# Altium project Hardware Design.PrjPcb (part 1 of 2)
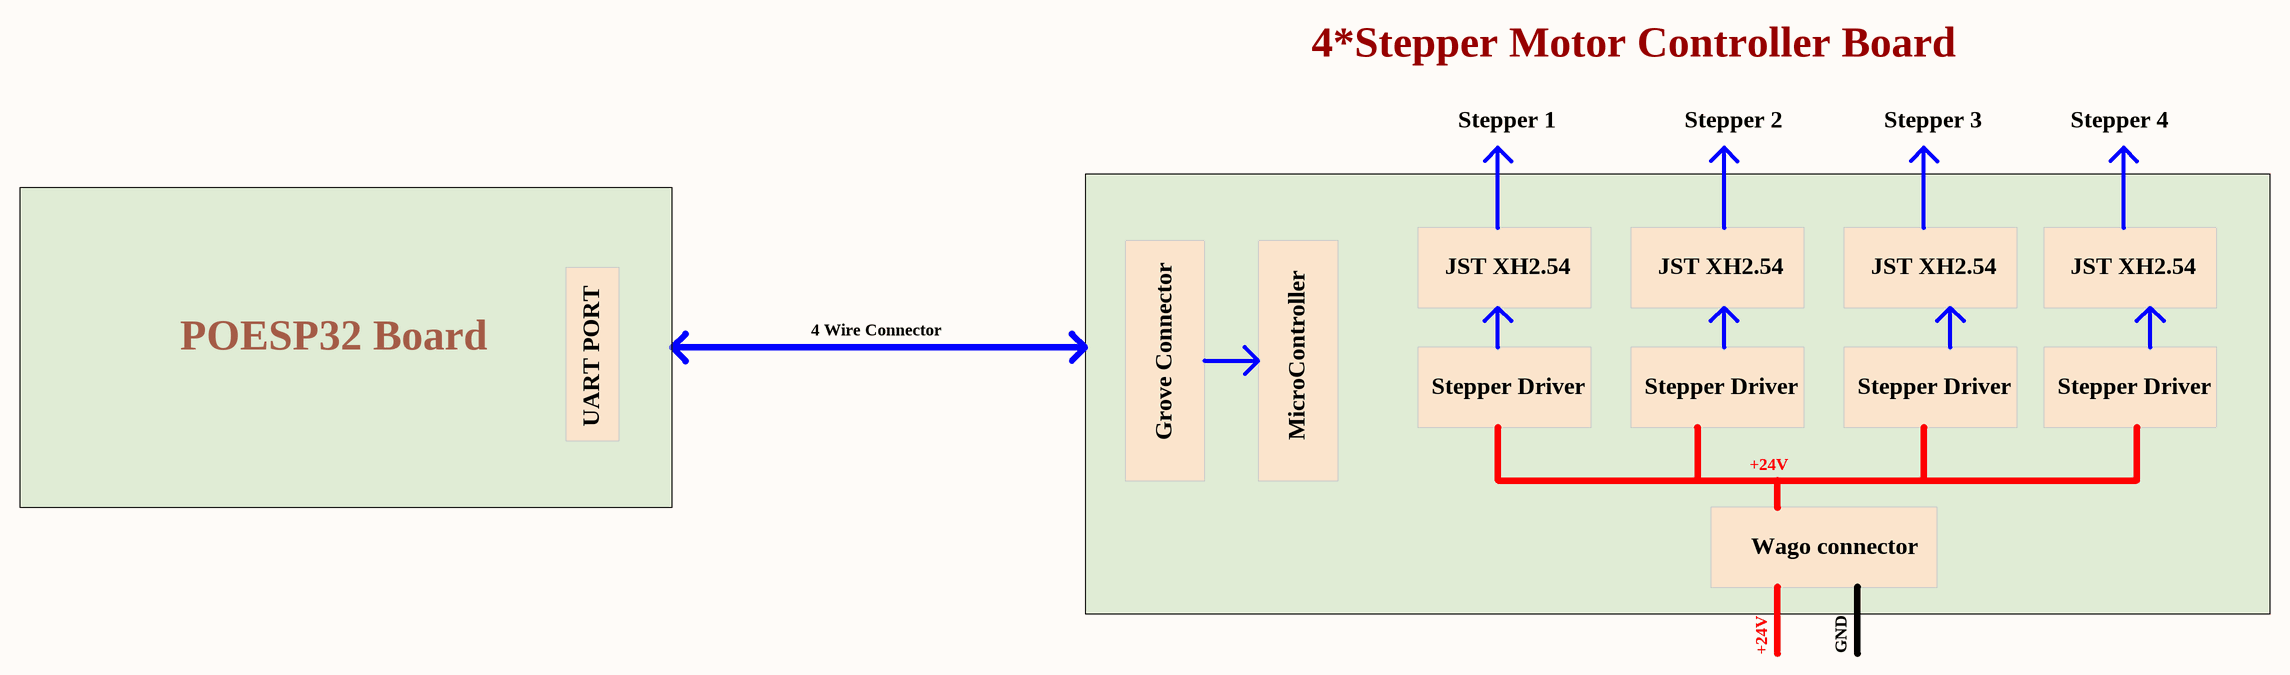
[diagram p0: SysOverView.SchDoc]
9 sheets, 264 parts. Net scope: global (net labels, ports and power ports of the same name join across sheets).
Board file: SystemV1.PcbDoc
Sheets:
  SysOverView.SchDoc
  POWER.SchDoc
  STM.SchDoc
  Stepper Motor1.SchDoc
  Stepper Motor2.SchDoc
  Stepper Motor3.SchDoc
  Stepper Motor4.SchDoc
  Stepper Motor5.SchDoc
  Stepper Motor6.SchDoc

## Sheet SysOverView.SchDoc
size A2; SheetNumber: 1; SheetTotal: 7

### Notes on the sheet
- 4*Stepper Motor Controller Board
- Stepper 1
- Stepper 2
- Stepper 3
- Stepper 4
- JST XH2.54
- POESP32 Board
- 4 Wire Connector
- UART PORT
- Grove Connector
- MicroController
- Stepper Driver
- +24V
- Wago connector
- GND

## Sheet POWER.SchDoc
size A2; SheetNumber: 2; SheetTotal: 9
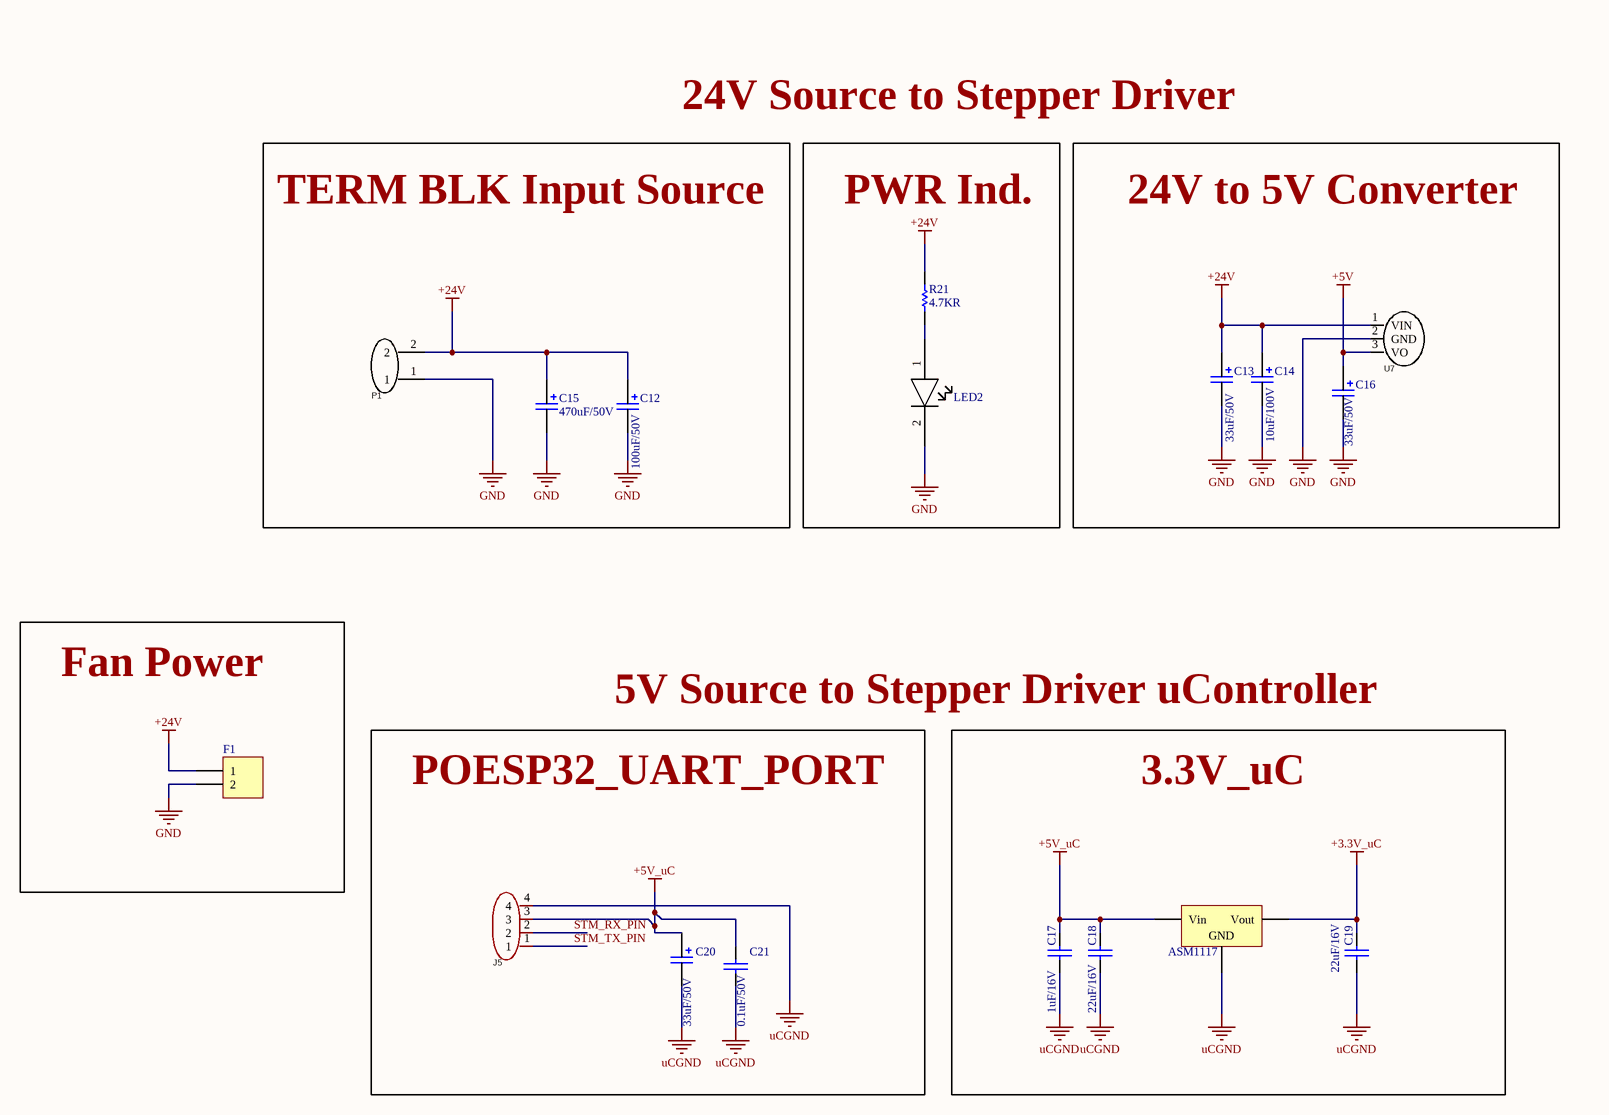
[diagram p1: POWER.SchDoc]

### Parts
ASM1117  AMS1117 - 3.3V Reg  [SOT229P700X180-4N]  (value not drawn)
C12  100uF/50V  [CAPLEAD_D6.3mm]
C13  33uF/50V  [CAPLEAD_D6.3mm]
C14  10uF/100V  [CAPLEAD_D6.3mm]
C15  470uF/50V  [CAPLEAD_D10mm]
C16  33uF/50V  [CAPLEAD_D6.3mm]
C17  1uF/16V  [PCBComponent_1]
C18  22uF/16V  [PCBComponent_1]
C19  22uF/16V  [PCBComponent_1]
C20  33uF/50V  [CAPLEAD_D6.3mm]
C21  0.1uF/50V  [PCBComponent_1]
F1  (no value)  [PinHeader Polar]
J5  Header 4P*2mm  [CONN-TH_4P-P2.00_HX20020-4A_2]  (value not drawn)
LED2  1206 LED  [1206 LED]  (value not drawn)
P1  WJ45C-B-9.5-2P  [CONN-TH_2P-P9.50_WJ45C-B-2P]  (value not drawn)
R21  4.7KR  [R0402]
U7  C5369649  [SIP-3]  (value not drawn)

### Blocks framed on the sheet
TERM BLK Input Source: C12 C15 P1
PWR Ind.: LED2 R21
24V to 5V Converter: C13 C14 C16 U7
Fan Power: F1
POESP32_UART_PORT: C20 C21 J5
3.3V_uC: ASM1117 C17-C19

### Nets
+3.3V_uC: ASM1117.Vout C19.2
+5V: C16.1 U7.3(VO)
+5V_uC: ASM1117.Vin C17.2 C18.2 C20.1 C21.2 J5.3
+24V: C12.1 C13.1 C14.1 C15.1 F1.1 P1.2 R21.1 U7.1(VIN)
GND: C12.2 C13.2 C14.2 C15.2 C16.2 F1.2 LED2.2 P1.1 U7.2(GND)
uCGND: ASM1117.GND C17.1 C18.1 C19.1 C20.2 C21.1 J5.4
STM_RX_PIN: J5.2
STM_TX_PIN: J5.1
NetLED2_1: LED2.1 R21.2

### Notes on the sheet
- 24V Source to Stepper Driver
- 5V Source to Stepper Driver uController

### Library data of the parts
ASM1117 = AMS1117 - 3.3V Reg: C347222; Created By: NourAldin
C12 = A759EQ475M2AAAE160: C47891; Manufacturer: KEMET; Supplier 1: Mouser; Manufacturer Part Number: A759EQ475M2AAAE160; RoHS: Yes; Category: Polymer Capacitors; Stock 1: 17219; Pricing 1: 1=0.97, 10=0.73, 50=0.73, 100=0.546, 1000=0.384, 10000=0.326 (USD); ComponentLink1URL: http://www.kemet.com/docfinder?Partnumber=A759EQ475M2AAAE160&src-supplier=Digikey; ComponentLink1Description: http://www.kemet.com/docfinder?Partnumber=A759EQ475M2AAAE160&src-supplier=Digikey; ComponentLink2URL: http://www.farnell.com/datasheets/2095614.pdf?src-supplier=Element14; ComponentLink2Description: http://www.farnell.com/datasheets/2095614.pdf?src-supplier=Element14; Supplier Part Number 1: 80-A759EQ475M2AAE160
C13 C16 C20 = A759EQ475M2AAAE160: C45099; Manufacturer: KEMET; Supplier 1: Mouser; Manufacturer Part Number: A759EQ475M2AAAE160; RoHS: Yes; Category: Polymer Capacitors; Stock 1: 17219; Pricing 1: 1=0.97, 10=0.73, 50=0.73, 100=0.546, 1000=0.384, 10000=0.326 (USD); ComponentLink1URL: http://www.kemet.com/docfinder?Partnumber=A759EQ475M2AAAE160&src-supplier=Digikey; ComponentLink1Description: http://www.kemet.com/docfinder?Partnumber=A759EQ475M2AAAE160&src-supplier=Digikey; ComponentLink2URL: http://www.farnell.com/datasheets/2095614.pdf?src-supplier=Element14; ComponentLink2Description: http://www.farnell.com/datasheets/2095614.pdf?src-supplier=Element14; Supplier Part Number 1: 80-A759EQ475M2AAE160
C14 = A759EQ475M2AAAE160: C2029; Manufacturer: KEMET; Supplier 1: Mouser; Manufacturer Part Number: A759EQ475M2AAAE160; RoHS: Yes; Category: Polymer Capacitors; Stock 1: 17219; Pricing 1: 1=0.97, 10=0.73, 50=0.73, 100=0.546, 1000=0.384, 10000=0.326 (USD); ComponentLink1URL: http://www.kemet.com/docfinder?Partnumber=A759EQ475M2AAAE160&src-supplier=Digikey; ComponentLink1Description: http://www.kemet.com/docfinder?Partnumber=A759EQ475M2AAAE160&src-supplier=Digikey; ComponentLink2URL: http://www.farnell.com/datasheets/2095614.pdf?src-supplier=Element14; ComponentLink2Description: http://www.farnell.com/datasheets/2095614.pdf?src-supplier=Element14; Supplier Part Number 1: 80-A759EQ475M2AAE160
C15 = MAL215058101E3: C2960279; Manufacturer: Vishay BCcomponents; Manufacturer Part Number: MAL215058101E3; RoHS: Yes; Category: Aluminum Electrolytic Capacitors; Stock 1: 1562; Pricing 1: 1=1.45, 10=1.09, 50=1.09, 100=0.799, 1000=0.585, 10000=0.496 (USD); ComponentLink1URL: https://datasheet.ciiva.com/11697/150rmi-11697723.pdf?src-supplier=Avnet; ComponentLink1Description: https://datasheet.ciiva.com/11697/150rmi-11697723.pdf?src-supplier=Avnet; Supplier 1: Mouser; Supplier 2: LCSC; Supplier Part Number 2: C1596751; Supplier Part Number 1: 594-2222-150-58101
C17 = 0603 Capacitor: C1592; Created By: NourAldin; DataSheet Link: https://eu.mouser.com/datasheet/2/400/lcc_automotive_general_en-843974.pdf; Mouser Link: https://eu.mouser.com/ProductDetail/TDK/CGA1A2X7R1H331M030BA?qs=sGAEpiMZZMs0AnBnWHyRQL8L3bkL%252bvtyS9XpSB1mk7rVV5K8%252bbxEeg%3d%3d
C18 C19 = 0603 Capacitor: C2762594; Created By: NourAldin; DataSheet Link: https://eu.mouser.com/datasheet/2/400/lcc_automotive_general_en-843974.pdf; Mouser Link: https://eu.mouser.com/ProductDetail/TDK/CGA1A2X7R1H331M030BA?qs=sGAEpiMZZMs0AnBnWHyRQL8L3bkL%252bvtyS9XpSB1mk7rVV5K8%252bbxEeg%3d%3d
C21 = 0603 Capacitor: C1591; Created By: NourAldin; DataSheet Link: https://eu.mouser.com/datasheet/2/400/lcc_automotive_general_en-843974.pdf; Mouser Link: https://eu.mouser.com/ProductDetail/TDK/CGA1A2X7R1H331M030BA?qs=sGAEpiMZZMs0AnBnWHyRQL8L3bkL%252bvtyS9XpSB1mk7rVV5K8%252bbxEeg%3d%3d
F1 = Header 2 pin: C492401; Created By: NourAldin
J5 = ZX-HY2.0-4PZZ: C42372479; Manufacturer: Megastar(兆星); Add into BOM: yes; Pins Structure: 1x4P; Pitch: 2mm; Reference Series: HY; Number of PINs Per Row: 4; Current Rating (Max): 2A; Rated Voltage (Max): 250V; Flame Retardant Rating: UL94V-0; Z-Height of the Board: 8mm; X-Length of Bottom Edge on Board (Spacing Line): 10mm; Y-Width of Bottom Edge on Board: 5.1mm; Symbol: ZX-HY2.0-4PZZ; Device: ZX-HY2.0-4PZZ; LCSC Part Name: 1x4P 间距:2mm 直插 系列:HY 配套胶壳型号：ZX-HY2.0-4PJK 配套端子型号：ZX-HY2.0-DZ 配套杜邦线型号：ZX-HY2.0-4PBXC; Supplier Part: C7429580; Manufacturer Part: ZX-HY2.0-4PZZ; Supplier Footprint: 插件,P=2mm; JLCPCB Part Class: Extended Part; Datasheet: https://atta.szlcsc.com/upload/public/pdf/source/20241025/5A7CD93910E89EF197073334521200FC.pdf; Supplier: LCSC; Convert to PCB: yes; Mounting Style: Direct Insert; Number of Pins: 4P; Number of Rows: 1; Row Spacing: -; Contact Material: Brass; Contact Plating: Tin; Operating Temperature Range: -25℃~+85℃; Plastic Material: -; Supplementary Features: -; Colour: White
LED2 = 1206 LED: C434442; Created By: NourAldin
P1 = WJ45C-B-9.5-2P: C8397; Manufacturer: KANGNEX(康奈克斯电气); Symbol: WJ45C-B-2P; Add into BOM: yes; Barrier Type: 两面; Pitch: 9.5mm; Structure: 1x2P; Pin Location: 中脚; Current Rating (Max): 32A; Voltage Rating (Max): 750V; Wire Gauge - AWG: 12~22; Wire Gauge - mm2: 4; Number of PINs Per Row: 2; Device: WJ45C-B-9.5-2P; LCSC Part Name: 9.5mm 1x2P 每排P数:2 排数:1 直针 中脚; Supplier Part: C8397; Manufacturer Part: WJ45C-B-9.5-2P; Supplier Footprint: 插件,P=9.5mm; JLCPCB Part Class: Extended Part; Datasheet: https://atta.szlcsc.com/upload/public/pdf/source/20191225/C8397_C0B2C2E73138A510EBF0F13B91F71912.pdf; Supplier: LCSC; Convert to PCB: yes; Mounting Style: 直针; Number of Pins: 2P; Number of Rows: 1; Operating Temperature Range: -40℃~+105℃; Color: Black
R21 = 0402 Resistor: C105871
U7 = K7805M-1000R3_C5369649: Manufacturer: YLPTEC(易川); Add into BOM: yes; Conversion Type: DC-DC; Function: Boost type; Input Voltage(DC): 7V~36V; Output Voltage: 5V; Output Power: 5W; Output Current (Max): 1000mA; Output Channel: 1; Conversion Efficiency: 94%; Maximum Capacitive Load: 2200uF; Symbol: K7805M-1000R3_C5369649; Device: K7805M-1000R3_C5369649; LCSC Part Name: K7805M-1000R3; Supplier Part: C5369649; Manufacturer Part: K7805M-1000R3; Supplier Footprint: SIP-3; JLCPCB Part Class: Extended Part; Datasheet: https://atta.szlcsc.com/upload/public/pdf/source/20230612/70568B8922D00E56BE7D7C892197C716.pdf; Supplier: LCSC; Convert to PCB: yes; Feature: Short-Circuit  Protection；Low-Power Consumption

## Sheet STM.SchDoc
size B; SheetNumber: 3; SheetTotal: 9
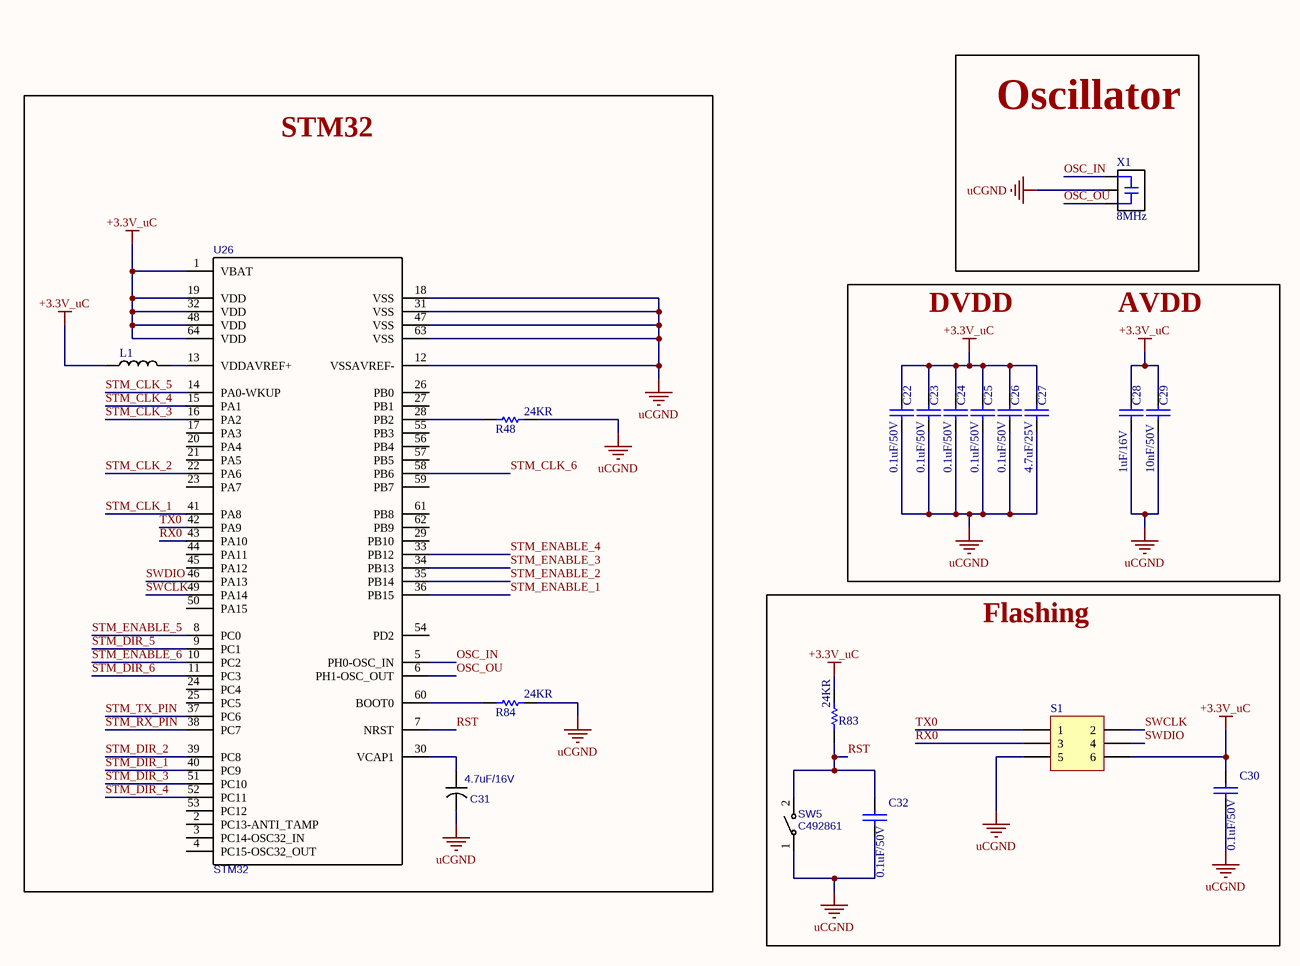
[diagram p2: STM.SchDoc]

### Parts
C22  0.1uF/50V  [PCBComponent_1]
C23  0.1uF/50V  [PCBComponent_1]
C24  0.1uF/50V  [PCBComponent_1]
C25  0.1uF/50V  [PCBComponent_1]
C26  0.1uF/50V  [PCBComponent_1]
C27  4.7uF/25V  [PCBComponent_1]
C28  1uF/16V  [PCBComponent_1]
C29  10nF/50V  [PCBComponent_1]
C30  0.1uF/50V  [PCBComponent_1]
C31  4.7uF/16V  [CASE-B_3528]
C32  0.1uF/50V  [PCBComponent_1]
L1  CMI201209X100KT  [INDC2012X06N]  (value not drawn)
R48  24KR  [RESC1608X06N]
R83  24KR  [RESC1608X06N]
R84  24KR  [RESC1608X06N]
S1  Header 3X2  [HDR2X3]  (value not drawn)
SW5  C492861  [SW-SMD_L4.0-W3.0-LS4.8]
U26  STM32  [LQFP-64_L10.0-W10.0-P0.50-LS12.0-BL]
X1  8MHz  [SMD3213-3P]

### Blocks framed on the sheet
Oscillator: X1
STM32: C31 L1 R48 R84 U26
Flashing: C30 C32 R83 S1 SW5

### Nets
+3.3V_uC: C22.2 C23.2 C24.2 C25.2 C26.2 C27.2 C28.2 C29.2 C30.2 L1.1 R83.1 S1.6 U26.1(VBAT) U26.19(VDD) U26.32(VDD) U26.48(VDD) U26.64(VDD)
uCGND: C22.1 C23.1 C24.1 C25.1 C26.1 C27.1 C28.1 C29.1 C30.1 C31.2 C32.1 R48.1 R84.1 S1.5 SW5.1 U26.12(VSSAVREF-) U26.18(VSS) U26.31(VSS) U26.47(VSS) U26.63(VSS) X1.2
OSC_IN: U26.5(PH0-OSC_IN) X1.1
OSC_OU: U26.6(PH1-OSC_OUT) X1.3
RST: C32.2 R83.2 SW5.2 U26.7(NRST)
RX0: S1.3 U26.43(PA10)
STM_CLK_1: U26.41(PA8)
STM_CLK_2: U26.22(PA6)
STM_CLK_3: U26.16(PA2)
STM_CLK_4: U26.15(PA1)
STM_CLK_5: U26.14(PA0-WKUP)
STM_CLK_6: U26.58(PB6)
STM_DIR_1: U26.40(PC9)
STM_DIR_2: U26.39(PC8)
STM_DIR_3: U26.51(PC10)
STM_DIR_4: U26.52(PC11)
STM_DIR_5: U26.9(PC1)
STM_DIR_6: U26.11(PC3)
STM_ENABLE_1: U26.36(PB15)
STM_ENABLE_2: U26.35(PB14)
STM_ENABLE_3: U26.34(PB13)
STM_ENABLE_4: U26.33(PB12)
STM_ENABLE_5: U26.8(PC0)
STM_ENABLE_6: U26.10(PC2)
STM_RX_PIN: U26.38(PC7)
STM_TX_PIN: U26.37(PC6)
SWCLK: S1.2 U26.49(PA14)
SWDIO: S1.4 U26.46(PA13)
TX0: S1.1 U26.42(PA9)
NetC31_1: C31.1 U26.30(VCAP1)
NetL1_2: L1.2 U26.13(VDDAVREF+)
NetR48_2: R48.2 U26.28(PB2)
NetR84_2: R84.2 U26.60(BOOT0)

Not connected (* = marked no-connect by the designer): U26 2(PC13-ANTI_TAMP) 3(PC14-OSC32_IN) 4(PC15-OSC32_OUT) 17(PA3) 20(PA4) 21(PA5) 23(PA7) 24(PC4) 25(PC5) 26(PB0) 27(PB1) 29(PB10) 44(PA11) 45(PA12) 50(PA15) 53(PC12) 54(PD2) 55(PB3) 56(PB4) 57(PB5) 59(PB7) 61(PB8) 62(PB9)

### Notes on the sheet
- DVDD
- AVDD

### Library data of the parts
C22-C26 C30 C32 = 0603 Capacitor: C1591; Created By: NourAldin; DataSheet Link: https://eu.mouser.com/datasheet/2/400/lcc_automotive_general_en-843974.pdf; Mouser Link: https://eu.mouser.com/ProductDetail/TDK/CGA1A2X7R1H331M030BA?qs=sGAEpiMZZMs0AnBnWHyRQL8L3bkL%252bvtyS9XpSB1mk7rVV5K8%252bbxEeg%3d%3d
C27 = 0603 Capacitor: C69335; Created By: NourAldin; DataSheet Link: https://eu.mouser.com/datasheet/2/400/lcc_automotive_general_en-843974.pdf; Mouser Link: https://eu.mouser.com/ProductDetail/TDK/CGA1A2X7R1H331M030BA?qs=sGAEpiMZZMs0AnBnWHyRQL8L3bkL%252bvtyS9XpSB1mk7rVV5K8%252bbxEeg%3d%3d
C28 = 0603 Capacitor: C1592; Created By: NourAldin; DataSheet Link: https://eu.mouser.com/datasheet/2/400/lcc_automotive_general_en-843974.pdf; Mouser Link: https://eu.mouser.com/ProductDetail/TDK/CGA1A2X7R1H331M030BA?qs=sGAEpiMZZMs0AnBnWHyRQL8L3bkL%252bvtyS9XpSB1mk7rVV5K8%252bbxEeg%3d%3d
C29 = 0603 Capacitor: C100042; Created By: NourAldin; DataSheet Link: https://eu.mouser.com/datasheet/2/400/lcc_automotive_general_en-843974.pdf; Mouser Link: https://eu.mouser.com/ProductDetail/TDK/CGA1A2X7R1H331M030BA?qs=sGAEpiMZZMs0AnBnWHyRQL8L3bkL%252bvtyS9XpSB1mk7rVV5K8%252bbxEeg%3d%3d
C31 = 3528  Tantalum Cap: C7206; Manufacturer: Kyocera AVX; Manufacturer Part: TAJR106K006RNJ; nameAlias: Value; Contributor: LCSC; Supplier: LCSC; Supplier Part: C132274; JLCPCB Part Class: Extended Part; spicePre: C; spiceSymbolName: TAJR106K006RNJ
L1 = 0805 SMD INDUCTOR: C99366; Created By: NourAldin
R48 R83 R84 = 0603 Resistor: C2930081; Created By: NourAldin; Mouser Link: https://eu.mouser.com/ProductDetail/Panasonic/ERA-3AHD180V?qs=sGAEpiMZZMvdGkrng054t5mej2KPdPuFSlDBd1tSiF0%3d; DataSheet Link: https://eu.mouser.com/datasheet/2/315/AOA0000C307-1149632.pdf
S1 = Header 3X2: C42431837; LatestRevisionDate: 17-Jul-2002; LatestRevisionNote: Re-released for DXP Platform.; Publisher: Altium Limited
SW5 = tact switch: Manufacturer: Yuandi(元迪); Manufacturer Part: TS-1071AS-A1B3-D4; Contributor: LCSC; Supplier: LCSC; Supplier Part: C492861; JLCPCB Part Class: Extended Part; spicePre: S; spiceSymbolName: TS-1071AS-A1B3-D4
U26 = STM32F401RCT6: C74524; Manufacturer: ST(意法半导体); Supplier: LCSC; Manufacturer Part: STM32F401RCT6; Supplier Part: C74524; JLCPCB Part Class: Extended Part; spicePre: U; spiceSymbolName: STM32F401RCT6
X1 = CSTCE16M0V53-R0: C907975; Manufacturer: Murata; Frequency: 16MHz; Frequency Stability: 0.3%; Frequency Tolerance: 0.5%; Capacitance: 15pF; Impedance: 40R; Supplier 1: Digi-Key; Manufacturer Part Number: CSTCE16M0V53-R0; RoHS: Yes; Category: Resonators; Mount: Surface Mount; Case/Package: SMD/SMT; Min Operating Temperature: -40°C; Max Operating Temperature: 85°C; Packaging: Cut Tape; Series: CERALOCK® CSTNE; RoHS Compliant: Yes; ComponentLink1URL: https://www.murata.com/en/products/productdata/8801162231838/SPEC-CSTNE16M0V530000R0.pdf?src-supplier=Digi-Key; ComponentLink1Description: https://www.murata.com/en/products/productdata/8801162231838/SPEC-CSTNE16M0V530000R0.pdf?src-supplier=Digi-Key; LCSC Link: https://www.lcsc.com/product-detail/Ceramic-Resonators_Murata-Electronics-CSTCE16M0V53-R0_C32180.html; Supplier Part Number 1: 490-1198-2-ND; Supplier Part Number 2: C32180

## Sheet Stepper Motor1.SchDoc
size A2; SheetNumber: 4; SheetTotal: 9
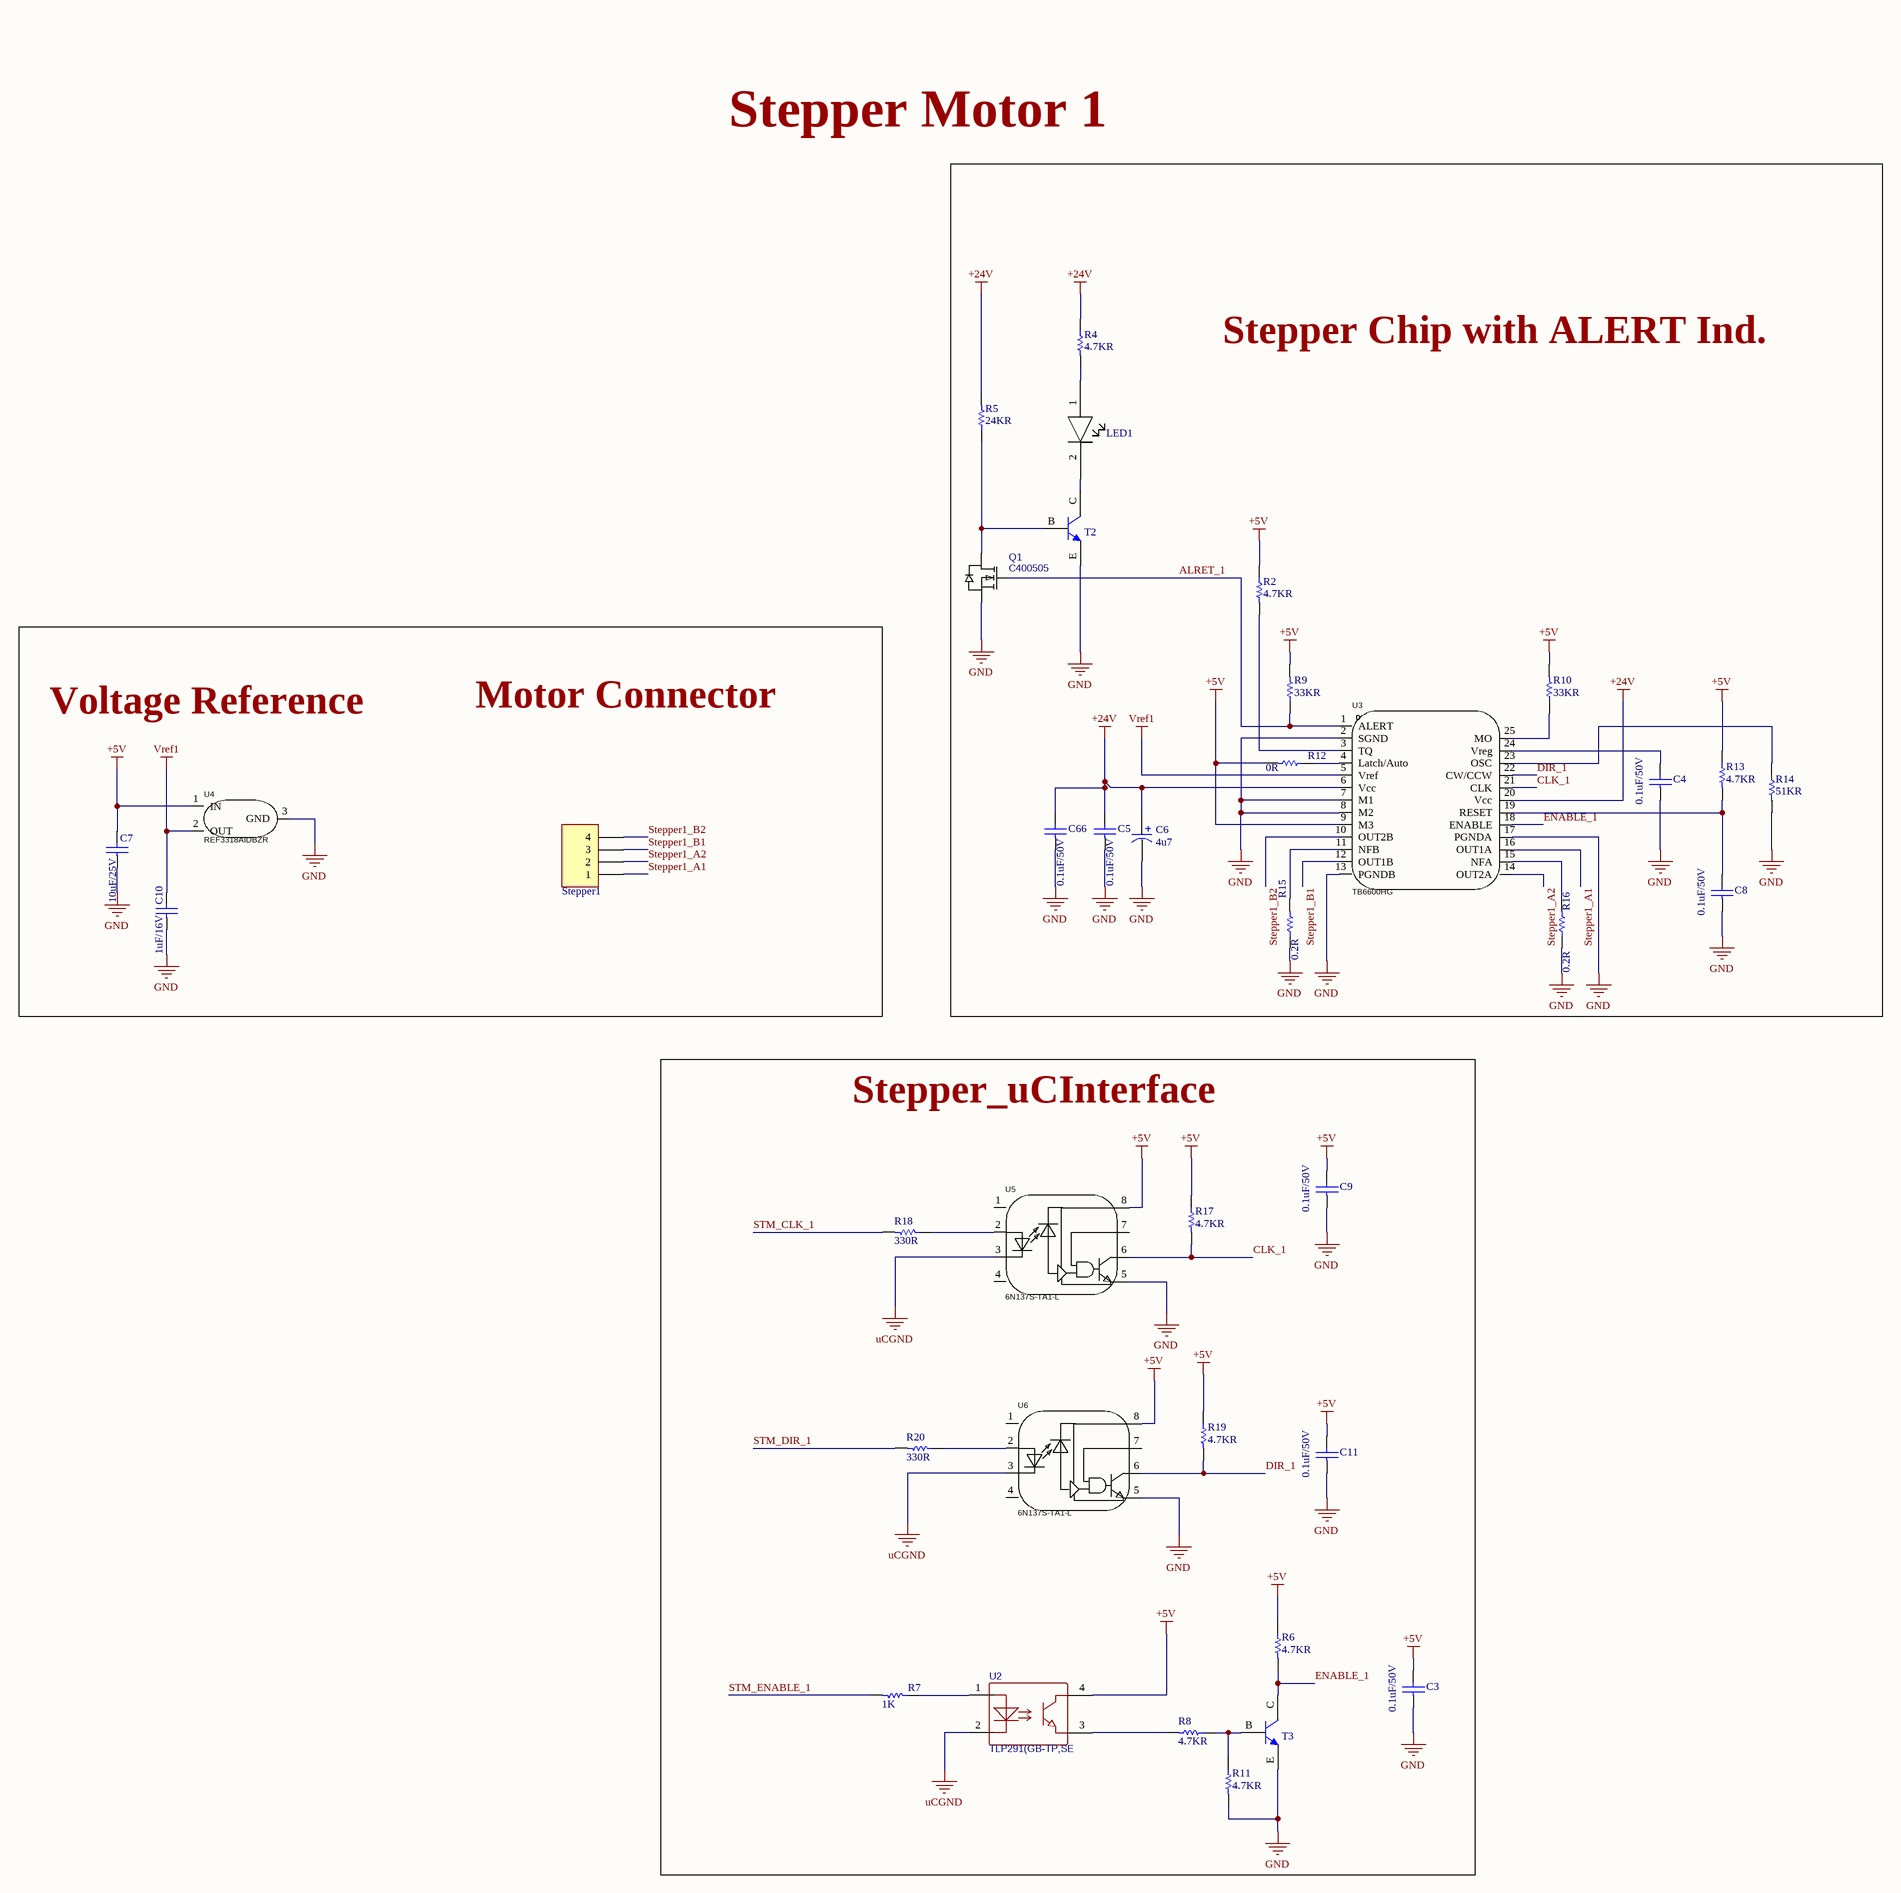
[diagram p3: Stepper Motor1.SchDoc]

### Parts
C3  0.1uF/50V  [PCBComponent_1]
C4  0.1uF/50V  [PCBComponent_1]
C5  0.1uF/50V  [PCBComponent_1]
C6  4u7  [CAPLEAD_D6.3mm]
C7  10uF/25V  [PCBComponent_1]
C8  0.1uF/50V  [PCBComponent_1]
C9  0.1uF/50V  [PCBComponent_1]
C10  1uF/16V  [PCBComponent_1]
C11  0.1uF/50V  [PCBComponent_1]
C66  0.1uF/50V  [PCBComponent_1]
LED1  1206 LED  [1206 LED]  (value not drawn)
Q1  C400505  [SOT-23-3_L2.9-W1.3-P1.90-LS2.4-BR]
R2  4.7KR  [R0402]
R4  4.7KR  [R0402]
R5  24KR  [RESC1608X06N]
R6  4.7KR  [R0402]
R7  1K  [R0402]
R8  4.7KR  [R0402]
R9  33KR  [RESC1608X06N]
R10  33KR  [RESC1608X06N]
R11  4.7KR  [R0402]
R12  0R  [RESC1608X06N]
R13  4.7KR  [R0402]
R14  51KR  [R0402]
R15  0.2R  [RESC6431X12N]
R16  0.2R  [RESC6431X12N]
R17  4.7KR  [R0402]
R18  330R  [R0402]
R19  4.7KR  [R0402]
R20  330R  [R0402]
Stepper1  Header 4 Pin Polar  [PCBComponent_1]  (value not drawn)
T2  MMBT3904 Transistor  [MMBT3904]  (value not drawn)
T3  MMBT3904 Transistor  [MMBT3904]  (value not drawn)
U2  TLP291(GB-TP,SE  [SOP-4-1.27mm]
U3  TB6600HG  [HZIP25-P-1.0_TB6600HG - HEATSINK]
U4  REF3318AIDBZR  [SOT-23-3_L2.9-W1.3-P1.90-LS2.4-BR]
U5  6N137S-TA1-L  [SOP-8_L9.8-W6.6-P2.54-LS10.3-BL]
U6  6N137S-TA1-L  [SOP-8_L9.8-W6.6-P2.54-LS10.3-BL]

### Blocks framed on the sheet
Stepper Chip with ALERT Ind.: C4-C6 C8 C66 LED1 Q1 R2 R4 R5 R9 R10 R12-R16 T2 U3
Stepper_uCInterface: C3 C9 C11 R6-R8 R11 R17-R20 T3 U2 U5 U6

### Nets
+5V: C3.2 C7.2 C9.2 C11.2 R2.1 R6.1 R9.2 R10.2 R12.2 R13.1 R17.1 R19.1 U2.4 U3.9(M3) U4.1(IN) U5.8 U6.8
+24V: C5.2 C6.1 C66.2 R4.1 R5.2 U3.6(Vcc) U3.20(Vcc)
GND: C3.1 C4.1 C5.1 C6.2 C7.1 C8.1 C9.1 C10.1 C11.1 C66.1 Q1.2(S) R11.2 R14.2 R15.1 R16.1 T2.E T3.E U3.2(SGND) U3.7(M1) U3.8(M2) U3.13(PGNDB) U3.17(PGNDA) U4.3(GND) U5.5 U6.5
uCGND: U2.2 U5.3 U6.3
Vref1: C10.2 U3.5(Vref) U4.2(OUT)
ALRET_1: Q1.1(G) R9.1 U3.1(ALERT)
CLK_1: R17.2 U3.21(CLK) U5.6
DIR_1: R19.2 U3.22(CW/CCW) U6.6
ENABLE_1: R6.2 T3.C U3.18(ENABLE)
Stepper1_A1: Stepper1.1 U3.16(OUT1A)
Stepper1_A2: Stepper1.2 U3.14(OUT2A)
Stepper1_B1: Stepper1.3 U3.12(OUT1B)
Stepper1_B2: Stepper1.4 U3.10(OUT2B)
STM_CLK_1: R18.2
STM_DIR_1: R20.2
STM_ENABLE_1: R7.2
NetC4_2: C4.2 U3.24(Vreg)
NetC8_2: C8.2 R13.2 U3.19(RESET)
NetLED1_1: LED1.1 R4.2
NetLED1_2: LED1.2 T2.C
NetQ1_3: Q1.3(D) R5.1 T2.B
NetR2_2: R2.2 U3.3(TQ)
NetR7_1: R7.1 U2.1
NetR8_1: R8.1 R11.1 T3.B
NetR8_2: R8.2 U2.3
NetR10_1: R10.1 U3.25(MO)
NetR12_1: R12.1 U3.4(Latch/Auto)
NetR14_1: R14.1 U3.23(OSC)
NetR15_2: R15.2 U3.11(NFB)
NetR16_2: R16.2 U3.15(NFA)
NetR18_1: R18.1 U5.2
NetR20_1: R20.1 U6.2

Not connected (* = marked no-connect by the designer): U5 1(NC) 4(NC) 7; U6 1(NC) 4(NC) 7

### Notes on the sheet
- Stepper Motor 1
- Voltage Reference
- Motor Connector

### Library data of the parts
C3-C5 C8 C9 C11 C66 = 0603 Capacitor: C1591; Created By: NourAldin; DataSheet Link: https://eu.mouser.com/datasheet/2/400/lcc_automotive_general_en-843974.pdf; Mouser Link: https://eu.mouser.com/ProductDetail/TDK/CGA1A2X7R1H331M030BA?qs=sGAEpiMZZMs0AnBnWHyRQL8L3bkL%252bvtyS9XpSB1mk7rVV5K8%252bbxEeg%3d%3d
C6 = A759EQ475M2AAAE160: C2691843; Manufacturer: KEMET; Supplier 1: Mouser; Manufacturer Part Number: A759EQ475M2AAAE160; RoHS: Yes; Category: Polymer Capacitors; Stock 1: 17219; Pricing 1: 1=0.97, 10=0.73, 50=0.73, 100=0.546, 1000=0.384, 10000=0.326 (USD); ComponentLink1URL: http://www.kemet.com/docfinder?Partnumber=A759EQ475M2AAAE160&src-supplier=Digikey; ComponentLink1Description: http://www.kemet.com/docfinder?Partnumber=A759EQ475M2AAAE160&src-supplier=Digikey; ComponentLink2URL: http://www.farnell.com/datasheets/2095614.pdf?src-supplier=Element14; ComponentLink2Description: http://www.farnell.com/datasheets/2095614.pdf?src-supplier=Element14; Supplier Part Number 1: 80-A759EQ475M2AAE160
C7 = 0603 Capacitor: C96446; Created By: NourAldin; DataSheet Link: https://eu.mouser.com/datasheet/2/400/lcc_automotive_general_en-843974.pdf; Mouser Link: https://eu.mouser.com/ProductDetail/TDK/CGA1A2X7R1H331M030BA?qs=sGAEpiMZZMs0AnBnWHyRQL8L3bkL%252bvtyS9XpSB1mk7rVV5K8%252bbxEeg%3d%3d
C10 = 0603 Capacitor: C1592; Created By: NourAldin; DataSheet Link: https://eu.mouser.com/datasheet/2/400/lcc_automotive_general_en-843974.pdf; Mouser Link: https://eu.mouser.com/ProductDetail/TDK/CGA1A2X7R1H331M030BA?qs=sGAEpiMZZMs0AnBnWHyRQL8L3bkL%252bvtyS9XpSB1mk7rVV5K8%252bbxEeg%3d%3d
LED1 = 1206 LED: C434438; Created By: NourAldin
Q1 = BSS138_MOSFET: Manufacturer: YANGJIE(扬杰); Manufacturer Part: BSS138; Contributor: LCSC; Supplier: LCSC; Supplier Part: C400505; JLCPCB Part Class: Extended Part; spicePre: Q; spiceSymbolName: BSS138_C400505
R2 R4 R6 R8 R11 R13 R17 R19 = 0402 Resistor: C105871
R5 = 0603 Resistor: C2930081; Created By: NourAldin; Mouser Link: https://eu.mouser.com/ProductDetail/Panasonic/ERA-3AHD180V?qs=sGAEpiMZZMvdGkrng054t5mej2KPdPuFSlDBd1tSiF0%3d; DataSheet Link: https://eu.mouser.com/datasheet/2/315/AOA0000C307-1149632.pdf
R7 = 0402 Resistor: C106235
R9 R10 = 0603 Resistor: C126359; Created By: NourAldin; Mouser Link: https://eu.mouser.com/ProductDetail/Panasonic/ERA-3AHD180V?qs=sGAEpiMZZMvdGkrng054t5mej2KPdPuFSlDBd1tSiF0%3d; DataSheet Link: https://eu.mouser.com/datasheet/2/315/AOA0000C307-1149632.pdf
R12 = 0603 Resistor: C100044; Created By: NourAldin; Mouser Link: https://eu.mouser.com/ProductDetail/Panasonic/ERA-3AHD180V?qs=sGAEpiMZZMvdGkrng054t5mej2KPdPuFSlDBd1tSiF0%3d; DataSheet Link: https://eu.mouser.com/datasheet/2/315/AOA0000C307-1149632.pdf
R14 = 0402 Resistor: C107230
R15 R16 = 2512 Resistor: C2903473; Created By: NourAldin; Mouser Link: https://eu.mouser.com/ProductDetail/Bourns/CSS2H-2512K-2L00F?qs=sGAEpiMZZMukHu%252bjC5l7YewuupLM8jZrvWs15Y6t0rY%3D&fbclid=IwAR0ZD_uc1Y03YG_KyYG8NxrpBzYgFzVeevvjxrlqtGWJ1HKz-jrYfqlFWCw; DataSheet Link: https://eu.mouser.com/datasheet/2/54/ss2h-2512-1302652.pdf
R18 R20 = 0402 Resistor: C105875
Stepper1 = Header 4 Pin Polar: C144395
T2 T3 = MMBT3904 Transistor: C108429; Created By: NourAldin
U2 = TLP291(GB-TP,SE(T: C55144; BOM_Manufacturer: TOSHIBA(东芝); BOM_Supplier: LCSC; Manufacturer Part Number: TLP291(GB-TP,SE; Supplier Part Number 2: C55144; BOM_JLCPCB Part Class: Extended Part; LCSC Link: https://www.lcsc.com/product-detail/Optocouplers-Phototransistor-Output_TOSHIBA-TLP291-GB-TP-SE_C55144.html; spiceSymbolName: TLP291(GB-TP,SE(T
U3 = TB6600HG: C66042; Manufacturer: TOSHIBA(东芝); Add into BOM: yes; Symbol: TB6600HG; Device: TB6600HG; LCSC Part Name: 4.5A 42V电机驱动芯片; Supplier Part: C66042; Manufacturer Part: TB6600HG; Supplier Footprint: HZIP-25-P-1mm; JLCPCB Part Class: Extended Part; Datasheet: https://atta.szlcsc.com/upload/public/pdf/source/20170511/1494500127812.pdf; Supplier: LCSC; Convert to PCB: yes
U4 = REF3318AIDBZR: C115877; Manufacturer: TI(德州仪器); Add into BOM: yes; Output Type: Fixed; Input Voltage: 2V~5.5V; Output Voltage: 1.8V; Output Current: 5mA; Tolerance: ±0.15%; Temperature Coefficient: 30ppm/℃; Reference Type: series connection; Supply Current: 8.5uA; Noise - 1/10Hz to 10Hz: 50uVp-p; Symbol: REF3318AIDBZR; Device: REF3318AIDBZR; LCSC Part Name: REF3318AIDBZR; Supplier Part: C115877; Manufacturer Part: REF3318AIDBZR; Supplier Footprint: SOT-23; JLCPCB Part Class: Extended Part; Datasheet: https://www.ti.com/cn/lit/gpn/ref3318; Supplier: LCSC; Convert to PCB: yes; Noise - 10Hz to 10kHz: -; Operating Temperature: -40℃~+125℃@(Ta)
U5 U6 = 6N137S-TA1-L: C92651; Manufacturer: LITEON(光宝); Add into BOM: yes; Input Type: DC; Supply Voltage: 4.5V~5.5V; Common Mode Transient Immunity (CMTI): 10kV/us; Data Rate: 15Mbit/s; Propagation Delay tpLH/tpHL: 32ns；40ns; Number of Channels: 1; Symbol: 6N137S-TA1; Device: 6N137S-TA1-L; LCSC Part Name: DC输入 1通道; Supplier Part: C92651; Manufacturer Part: 6N137S-TA1-L; Supplier Footprint: SOP-8-2.54mm; JLCPCB Part Class: Extended Part; Datasheet: https://atta.szlcsc.com/upload/public/pdf/source/20191018/C92651_D1F9F6F1F10C7EC7C3739E5ECB700036.pdf; Supplier: LCSC; Convert to PCB: yes; Operating Temperature: -40℃~+85℃

## Sheet Stepper Motor2.SchDoc
size A2; SheetNumber: 5; SheetTotal: 9
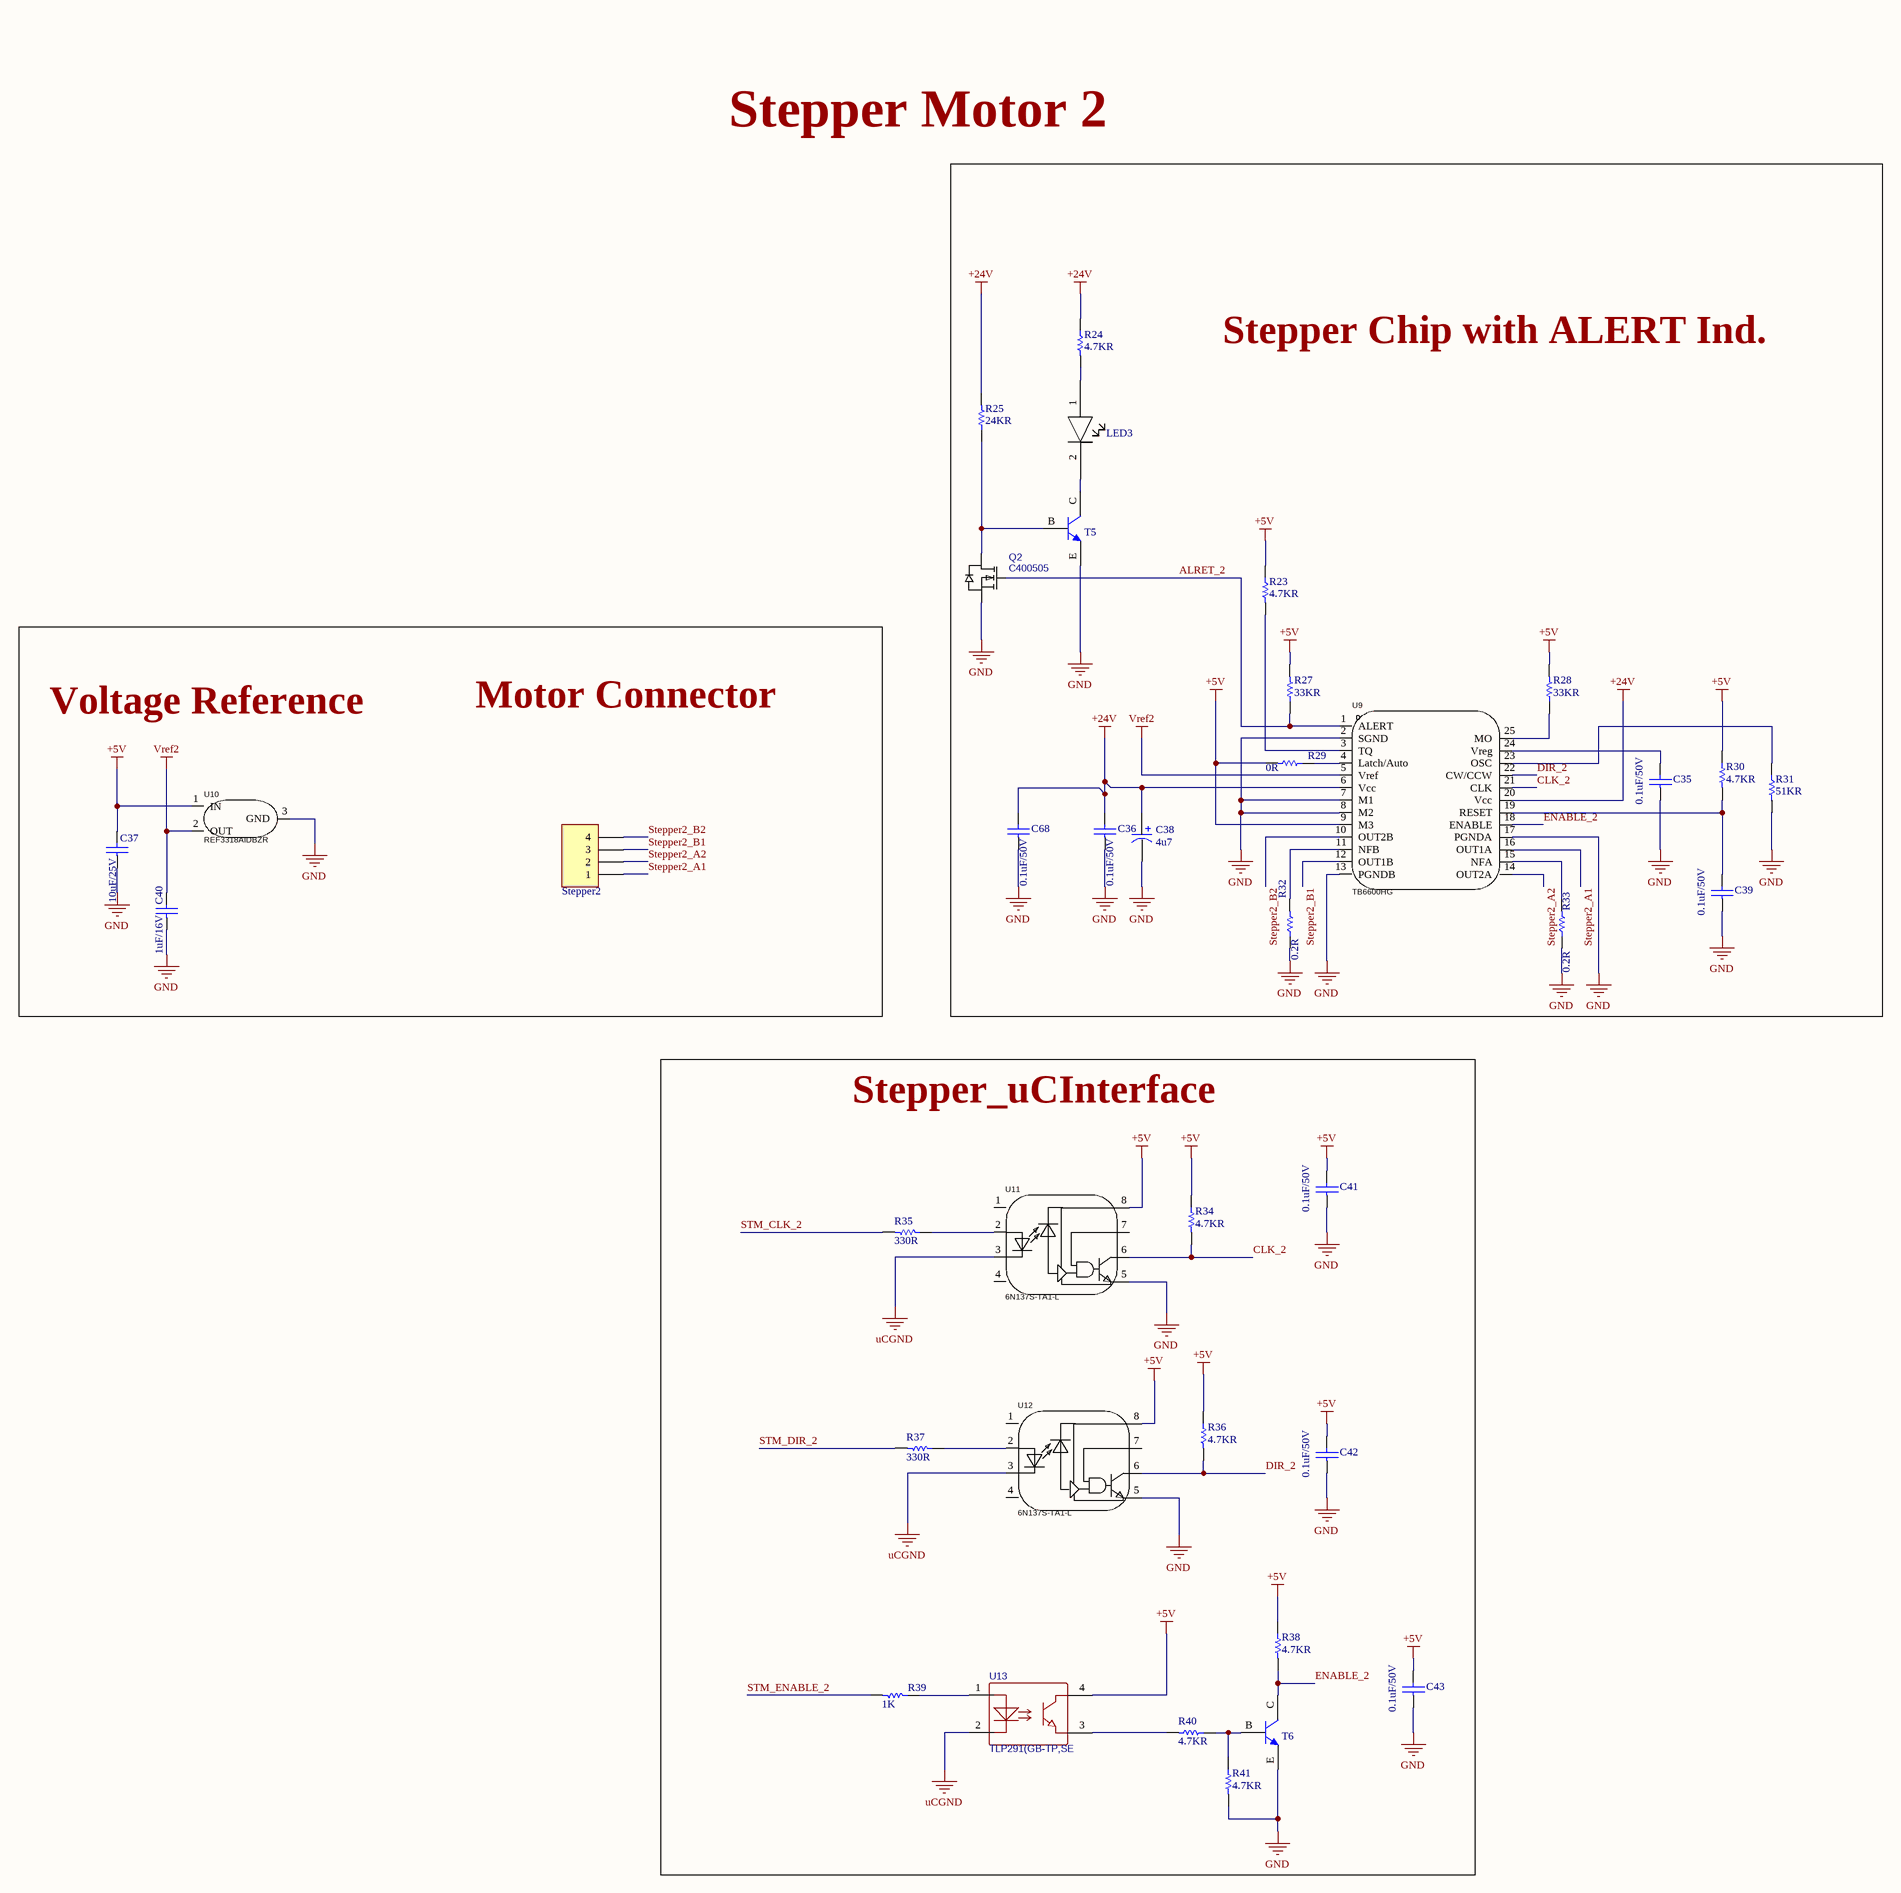
[diagram p4: Stepper Motor2.SchDoc]

### Parts
C35  0.1uF/50V  [PCBComponent_1]
C36  0.1uF/50V  [PCBComponent_1]
C37  10uF/25V  [PCBComponent_1]
C38  4u7  [CAPLEAD_D6.3mm]
C39  0.1uF/50V  [PCBComponent_1]
C40  1uF/16V  [PCBComponent_1]
C41  0.1uF/50V  [PCBComponent_1]
C42  0.1uF/50V  [PCBComponent_1]
C43  0.1uF/50V  [PCBComponent_1]
C68  0.1uF/50V  [PCBComponent_1]
LED3  1206 LED  [1206 LED]  (value not drawn)
Q2  C400505  [SOT-23-3_L2.9-W1.3-P1.90-LS2.4-BR]
R23  4.7KR  [R0402]
R24  4.7KR  [R0402]
R25  24KR  [RESC1608X06N]
R27  33KR  [RESC1608X06N]
R28  33KR  [RESC1608X06N]
R29  0R  [RESC1608X06N]
R30  4.7KR  [R0402]
R31  51KR  [R0402]
R32  0.2R  [RESC6431X12N]
R33  0.2R  [RESC6431X12N]
R34  4.7KR  [R0402]
R35  330R  [R0402]
R36  4.7KR  [R0402]
R37  330R  [R0402]
R38  4.7KR  [R0402]
R39  1K  [R0402]
R40  4.7KR  [R0402]
R41  4.7KR  [R0402]
Stepper2  Header 4 Pin Polar  [PCBComponent_1]  (value not drawn)
T5  MMBT3904 Transistor  [MMBT3904]  (value not drawn)
T6  MMBT3904 Transistor  [MMBT3904]  (value not drawn)
U9  TB6600HG  [HZIP25-P-1.0_TB6600HG - HEATSINK]
U10  REF3318AIDBZR  [SOT-23-3_L2.9-W1.3-P1.90-LS2.4-BR]
U11  6N137S-TA1-L  [SOP-8_L9.8-W6.6-P2.54-LS10.3-BL]
U12  6N137S-TA1-L  [SOP-8_L9.8-W6.6-P2.54-LS10.3-BL]
U13  TLP291(GB-TP,SE  [SOP-4-1.27mm]

### Blocks framed on the sheet
Stepper Chip with ALERT Ind.: C35 C36 C38 C39 C68 LED3 Q2 R23-R25 R27-R33 T5 U9
Stepper_uCInterface: C41-C43 R34-R41 T6 U11-U13

### Nets
+5V: C37.2 C41.2 C42.2 C43.2 R23.1 R27.2 R28.2 R29.2 R30.1 R34.1 R36.1 R38.1 U9.9(M3) U10.1(IN) U11.8 U12.8 U13.4
+24V: C36.2 C38.1 C68.2 R24.1 R25.2 U9.6(Vcc) U9.20(Vcc)
GND: C35.1 C36.1 C37.1 C38.2 C39.1 C40.1 C41.1 C42.1 C43.1 C68.1 Q2.2(S) R31.2 R32.1 R33.1 R41.2 T5.E T6.E U9.2(SGND) U9.7(M1) U9.8(M2) U9.13(PGNDB) U9.17(PGNDA) U10.3(GND) U11.5 U12.5
uCGND: U11.3 U12.3 U13.2
Vref2: C40.2 U9.5(Vref) U10.2(OUT)
ALRET_2: Q2.1(G) R27.1 U9.1(ALERT)
CLK_2: R34.2 U9.21(CLK) U11.6
DIR_2: R36.2 U9.22(CW/CCW) U12.6
ENABLE_2: R38.2 T6.C U9.18(ENABLE)
Stepper2_A1: Stepper2.1 U9.16(OUT1A)
Stepper2_A2: Stepper2.2 U9.14(OUT2A)
Stepper2_B1: Stepper2.3 U9.12(OUT1B)
Stepper2_B2: Stepper2.4 U9.10(OUT2B)
STM_CLK_2: R35.2
STM_DIR_2: R37.2
STM_ENABLE_2: R39.2
NetC35_2: C35.2 U9.24(Vreg)
NetC39_2: C39.2 R30.2 U9.19(RESET)
NetLED3_1: LED3.1 R24.2
NetLED3_2: LED3.2 T5.C
NetQ2_3: Q2.3(D) R25.1 T5.B
NetR23_2: R23.2 U9.3(TQ)
NetR28_1: R28.1 U9.25(MO)
NetR29_1: R29.1 U9.4(Latch/Auto)
NetR31_1: R31.1 U9.23(OSC)
NetR32_2: R32.2 U9.11(NFB)
NetR33_2: R33.2 U9.15(NFA)
NetR35_1: R35.1 U11.2
NetR37_1: R37.1 U12.2
NetR39_1: R39.1 U13.1
NetR40_1: R40.1 R41.1 T6.B
NetR40_2: R40.2 U13.3

Not connected (* = marked no-connect by the designer): U11 1(NC) 4(NC) 7; U12 1(NC) 4(NC) 7

### Notes on the sheet
- Stepper Motor 2
- Voltage Reference
- Motor Connector

### Library data of the parts
C35 C36 C39 C41-C43 C68 = 0603 Capacitor: C1591; Created By: NourAldin; DataSheet Link: https://eu.mouser.com/datasheet/2/400/lcc_automotive_general_en-843974.pdf; Mouser Link: https://eu.mouser.com/ProductDetail/TDK/CGA1A2X7R1H331M030BA?qs=sGAEpiMZZMs0AnBnWHyRQL8L3bkL%252bvtyS9XpSB1mk7rVV5K8%252bbxEeg%3d%3d
C37 = 0603 Capacitor: C96446; Created By: NourAldin; DataSheet Link: https://eu.mouser.com/datasheet/2/400/lcc_automotive_general_en-843974.pdf; Mouser Link: https://eu.mouser.com/ProductDetail/TDK/CGA1A2X7R1H331M030BA?qs=sGAEpiMZZMs0AnBnWHyRQL8L3bkL%252bvtyS9XpSB1mk7rVV5K8%252bbxEeg%3d%3d
C38 = A759EQ475M2AAAE160: C2691843; Manufacturer: KEMET; Supplier 1: Mouser; Manufacturer Part Number: A759EQ475M2AAAE160; RoHS: Yes; Category: Polymer Capacitors; Stock 1: 17219; Pricing 1: 1=0.97, 10=0.73, 50=0.73, 100=0.546, 1000=0.384, 10000=0.326 (USD); ComponentLink1URL: http://www.kemet.com/docfinder?Partnumber=A759EQ475M2AAAE160&src-supplier=Digikey; ComponentLink1Description: http://www.kemet.com/docfinder?Partnumber=A759EQ475M2AAAE160&src-supplier=Digikey; ComponentLink2URL: http://www.farnell.com/datasheets/2095614.pdf?src-supplier=Element14; ComponentLink2Description: http://www.farnell.com/datasheets/2095614.pdf?src-supplier=Element14; Supplier Part Number 1: 80-A759EQ475M2AAE160
C40 = 0603 Capacitor: C1592; Created By: NourAldin; DataSheet Link: https://eu.mouser.com/datasheet/2/400/lcc_automotive_general_en-843974.pdf; Mouser Link: https://eu.mouser.com/ProductDetail/TDK/CGA1A2X7R1H331M030BA?qs=sGAEpiMZZMs0AnBnWHyRQL8L3bkL%252bvtyS9XpSB1mk7rVV5K8%252bbxEeg%3d%3d
LED3 = 1206 LED: C434438; Created By: NourAldin
Q2 = BSS138_MOSFET: as Q1 on sheet Stepper Motor1; Supplier: LCSC; Supplier Part: C400505; JLCPCB Part Class: Extended Part; spicePre: Q; spiceSymbolName: BSS138_C400505
R23 R24 R30 R34 R36 R38 R40 R41 = 0402 Resistor: C105871
R25 = 0603 Resistor: C2930081; Created By: NourAldin; Mouser Link: https://eu.mouser.com/ProductDetail/Panasonic/ERA-3AHD180V?qs=sGAEpiMZZMvdGkrng054t5mej2KPdPuFSlDBd1tSiF0%3d; DataSheet Link: https://eu.mouser.com/datasheet/2/315/AOA0000C307-1149632.pdf
R27 R28 = 0603 Resistor: C126359; Created By: NourAldin; Mouser Link: https://eu.mouser.com/ProductDetail/Panasonic/ERA-3AHD180V?qs=sGAEpiMZZMvdGkrng054t5mej2KPdPuFSlDBd1tSiF0%3d; DataSheet Link: https://eu.mouser.com/datasheet/2/315/AOA0000C307-1149632.pdf
R29 = 0603 Resistor: C100044; Created By: NourAldin; Mouser Link: https://eu.mouser.com/ProductDetail/Panasonic/ERA-3AHD180V?qs=sGAEpiMZZMvdGkrng054t5mej2KPdPuFSlDBd1tSiF0%3d; DataSheet Link: https://eu.mouser.com/datasheet/2/315/AOA0000C307-1149632.pdf
R31 = 0402 Resistor: C107230
R32 R33 = 2512 Resistor: C2903473; Created By: NourAldin; Mouser Link: https://eu.mouser.com/ProductDetail/Bourns/CSS2H-2512K-2L00F?qs=sGAEpiMZZMukHu%252bjC5l7YewuupLM8jZrvWs15Y6t0rY%3D&fbclid=IwAR0ZD_uc1Y03YG_KyYG8NxrpBzYgFzVeevvjxrlqtGWJ1HKz-jrYfqlFWCw; DataSheet Link: https://eu.mouser.com/datasheet/2/54/ss2h-2512-1302652.pdf
R35 R37 = 0402 Resistor: C105875
R39 = 0402 Resistor: C106235
Stepper2 = Header 4 Pin Polar: C144395
T5 T6 = MMBT3904 Transistor: C108429; Created By: NourAldin
U9 = TB6600HG: as U3 on sheet Stepper Motor1; Symbol: TB6600HG; Device: TB6600HG; LCSC Part Name: 4.5A 42V电机驱动芯片; Supplier Part: C66042; Manufacturer Part: TB6600HG; Supplier Footprint: HZIP-25-P-1mm; JLCPCB Part Class: Extended Part; Datasheet: https://atta.szlcsc.com/upload/public/pdf/source/20170511/1494500127812.pdf; Supplier: LCSC; Convert to PCB: yes
U10 = REF3318AIDBZR: as U4 on sheet Stepper Motor1; Symbol: REF3318AIDBZR; Device: REF3318AIDBZR; LCSC Part Name: REF3318AIDBZR; Supplier Part: C115877; Manufacturer Part: REF3318AIDBZR; Supplier Footprint: SOT-23; JLCPCB Part Class: Extended Part; Datasheet: https://www.ti.com/cn/lit/gpn/ref3318; Supplier: LCSC; Convert to PCB: yes; Noise - 10Hz to 10kHz: -; Operating Temperature: -40℃~+125℃@(Ta)
U11 U12 = 6N137S-TA1-L: as U5 on sheet Stepper Motor1; Symbol: 6N137S-TA1; Device: 6N137S-TA1-L; LCSC Part Name: DC输入 1通道; Supplier Part: C92651; Manufacturer Part: 6N137S-TA1-L; Supplier Footprint: SOP-8-2.54mm; JLCPCB Part Class: Extended Part; Datasheet: https://atta.szlcsc.com/upload/public/pdf/source/20191018/C92651_D1F9F6F1F10C7EC7C3739E5ECB700036.pdf; Supplier: LCSC; Convert to PCB: yes; Operating Temperature: -40℃~+85℃
U13 = TLP291(GB-TP,SE(T: C55144; BOM_Manufacturer: TOSHIBA(东芝); BOM_Supplier: LCSC; Manufacturer Part Number: TLP291(GB-TP,SE; Supplier Part Number 2: C55144; BOM_JLCPCB Part Class: Extended Part; LCSC Link: https://www.lcsc.com/product-detail/Optocouplers-Phototransistor-Output_TOSHIBA-TLP291-GB-TP-SE_C55144.html; spiceSymbolName: TLP291(GB-TP,SE(T

## Sheet Stepper Motor3.SchDoc
size A2; SheetNumber: 6; SheetTotal: 9
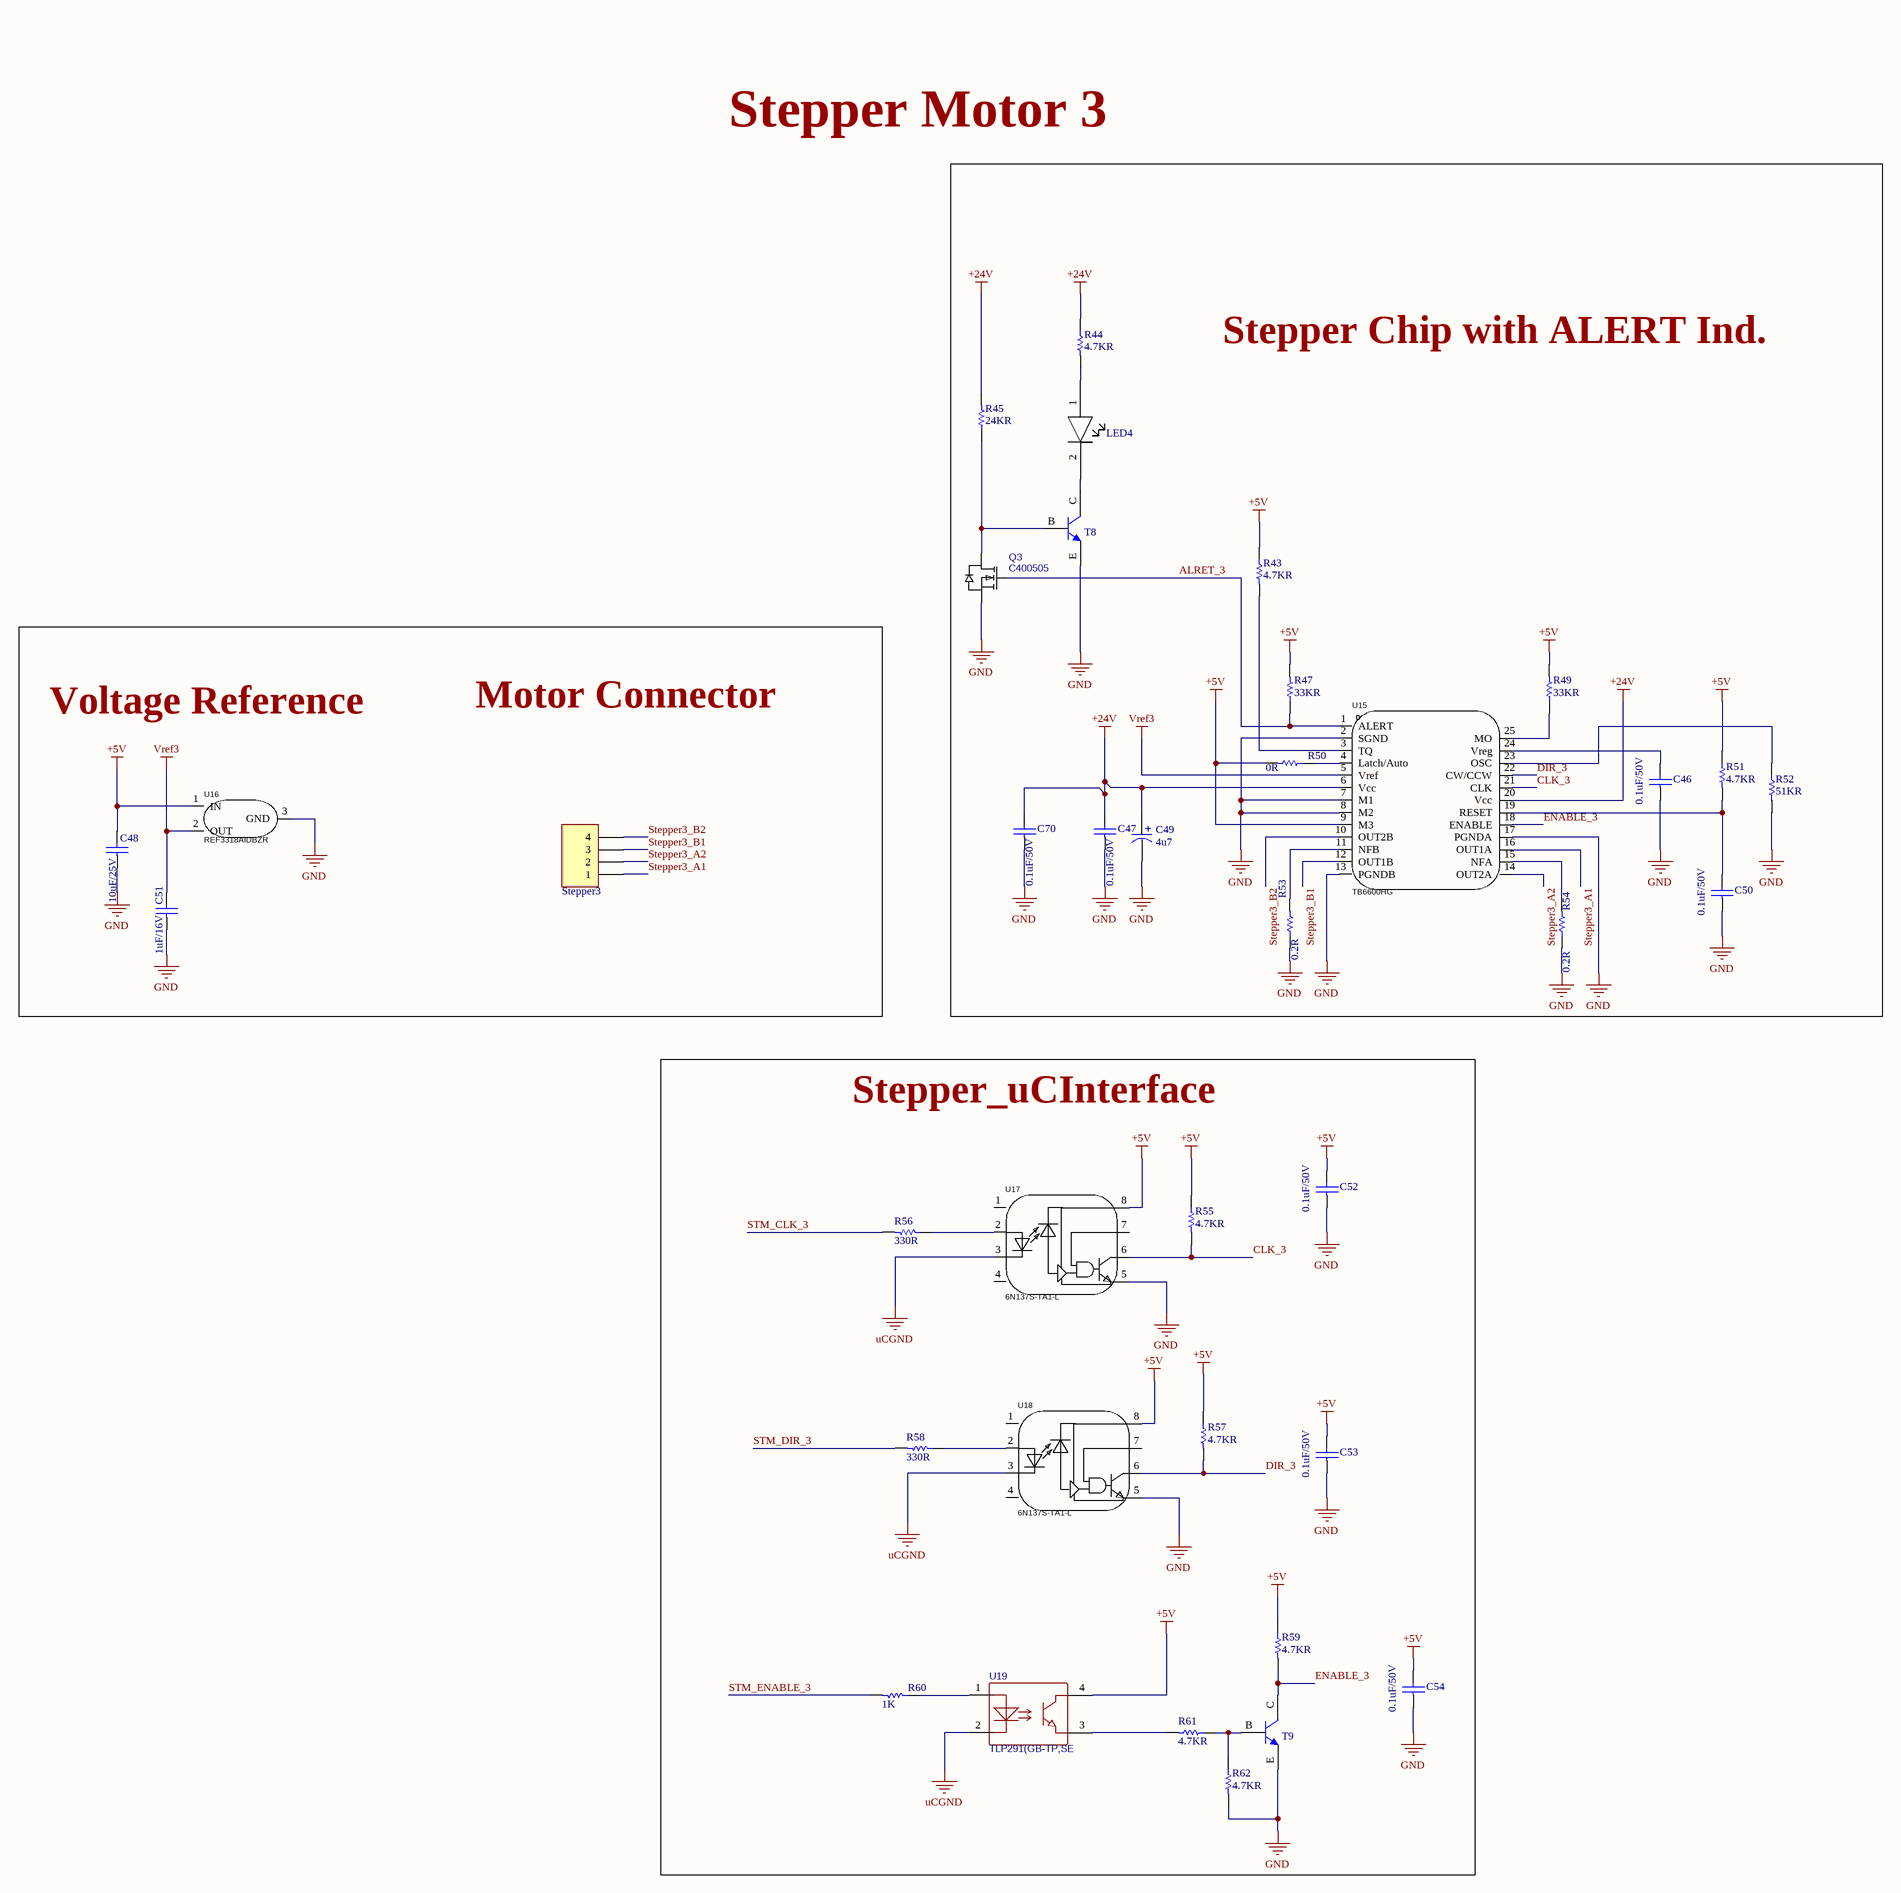
[diagram p5: Stepper Motor3.SchDoc]

### Parts
C46  0.1uF/50V  [PCBComponent_1]
C47  0.1uF/50V  [PCBComponent_1]
C48  10uF/25V  [PCBComponent_1]
C49  4u7  [CAPLEAD_D6.3mm]
C50  0.1uF/50V  [PCBComponent_1]
C51  1uF/16V  [PCBComponent_1]
C52  0.1uF/50V  [PCBComponent_1]
C53  0.1uF/50V  [PCBComponent_1]
C54  0.1uF/50V  [PCBComponent_1]
C70  0.1uF/50V  [PCBComponent_1]
LED4  1206 LED  [1206 LED]  (value not drawn)
Q3  C400505  [SOT-23-3_L2.9-W1.3-P1.90-LS2.4-BR]
R43  4.7KR  [R0402]
R44  4.7KR  [R0402]
R45  24KR  [RESC1608X06N]
R47  33KR  [RESC1608X06N]
R49  33KR  [RESC1608X06N]
R50  0R  [RESC1608X06N]
R51  4.7KR  [R0402]
R52  51KR  [R0402]
R53  0.2R  [RESC6431X12N]
R54  0.2R  [RESC6431X12N]
R55  4.7KR  [R0402]
R56  330R  [R0402]
R57  4.7KR  [R0402]
R58  330R  [R0402]
R59  4.7KR  [R0402]
R60  1K  [R0402]
R61  4.7KR  [R0402]
R62  4.7KR  [R0402]
Stepper3  Header 4 Pin Polar  [PCBComponent_1]  (value not drawn)
T8  MMBT3904 Transistor  [MMBT3904]  (value not drawn)
T9  MMBT3904 Transistor  [MMBT3904]  (value not drawn)
U15  TB6600HG  [HZIP25-P-1.0_TB6600HG - HEATSINK]
U16  REF3318AIDBZR  [SOT-23-3_L2.9-W1.3-P1.90-LS2.4-BR]
U17  6N137S-TA1-L  [SOP-8_L9.8-W6.6-P2.54-LS10.3-BL]
U18  6N137S-TA1-L  [SOP-8_L9.8-W6.6-P2.54-LS10.3-BL]
U19  TLP291(GB-TP,SE  [SOP-4-1.27mm]

### Blocks framed on the sheet
Stepper Chip with ALERT Ind.: C46 C47 C49 C50 C70 LED4 Q3 R43-R45 R47 R49-R54 T8 U15
Stepper_uCInterface: C52-C54 R55-R62 T9 U17-U19

### Nets
+5V: C48.2 C52.2 C53.2 C54.2 R43.1 R47.2 R49.2 R50.2 R51.1 R55.1 R57.1 R59.1 U15.9(M3) U16.1(IN) U17.8 U18.8 U19.4
+24V: C47.2 C49.1 C70.2 R44.1 R45.2 U15.6(Vcc) U15.20(Vcc)
GND: C46.1 C47.1 C48.1 C49.2 C50.1 C51.1 C52.1 C53.1 C54.1 C70.1 Q3.2(S) R52.2 R53.1 R54.1 R62.2 T8.E T9.E U15.2(SGND) U15.7(M1) U15.8(M2) U15.13(PGNDB) U15.17(PGNDA) U16.3(GND) U17.5 U18.5
uCGND: U17.3 U18.3 U19.2
Vref3: C51.2 U15.5(Vref) U16.2(OUT)
ALRET_3: Q3.1(G) R47.1 U15.1(ALERT)
CLK_3: R55.2 U15.21(CLK) U17.6
DIR_3: R57.2 U15.22(CW/CCW) U18.6
ENABLE_3: R59.2 T9.C U15.18(ENABLE)
Stepper3_A1: Stepper3.1 U15.16(OUT1A)
Stepper3_A2: Stepper3.2 U15.14(OUT2A)
Stepper3_B1: Stepper3.3 U15.12(OUT1B)
Stepper3_B2: Stepper3.4 U15.10(OUT2B)
STM_CLK_3: R56.2
STM_DIR_3: R58.2
STM_ENABLE_3: R60.2
NetC46_2: C46.2 U15.24(Vreg)
NetC50_2: C50.2 R51.2 U15.19(RESET)
NetLED4_1: LED4.1 R44.2
NetLED4_2: LED4.2 T8.C
NetQ3_3: Q3.3(D) R45.1 T8.B
NetR43_2: R43.2 U15.3(TQ)
NetR49_1: R49.1 U15.25(MO)
NetR50_1: R50.1 U15.4(Latch/Auto)
NetR52_1: R52.1 U15.23(OSC)
NetR53_2: R53.2 U15.11(NFB)
NetR54_2: R54.2 U15.15(NFA)
NetR56_1: R56.1 U17.2
NetR58_1: R58.1 U18.2
NetR60_1: R60.1 U19.1
NetR61_1: R61.1 R62.1 T9.B
NetR61_2: R61.2 U19.3

Not connected (* = marked no-connect by the designer): U17 1(NC) 4(NC) 7; U18 1(NC) 4(NC) 7

### Notes on the sheet
- Stepper Motor 3
- Voltage Reference
- Motor Connector

### Library data of the parts
C46 C47 C50 C52-C54 C70 = 0603 Capacitor: C1591; Created By: NourAldin; DataSheet Link: https://eu.mouser.com/datasheet/2/400/lcc_automotive_general_en-843974.pdf; Mouser Link: https://eu.mouser.com/ProductDetail/TDK/CGA1A2X7R1H331M030BA?qs=sGAEpiMZZMs0AnBnWHyRQL8L3bkL%252bvtyS9XpSB1mk7rVV5K8%252bbxEeg%3d%3d
C48 = 0603 Capacitor: C96446; Created By: NourAldin; DataSheet Link: https://eu.mouser.com/datasheet/2/400/lcc_automotive_general_en-843974.pdf; Mouser Link: https://eu.mouser.com/ProductDetail/TDK/CGA1A2X7R1H331M030BA?qs=sGAEpiMZZMs0AnBnWHyRQL8L3bkL%252bvtyS9XpSB1mk7rVV5K8%252bbxEeg%3d%3d
C49 = A759EQ475M2AAAE160: C2691843; Manufacturer: KEMET; Supplier 1: Mouser; Manufacturer Part Number: A759EQ475M2AAAE160; RoHS: Yes; Category: Polymer Capacitors; Stock 1: 17219; Pricing 1: 1=0.97, 10=0.73, 50=0.73, 100=0.546, 1000=0.384, 10000=0.326 (USD); ComponentLink1URL: http://www.kemet.com/docfinder?Partnumber=A759EQ475M2AAAE160&src-supplier=Digikey; ComponentLink1Description: http://www.kemet.com/docfinder?Partnumber=A759EQ475M2AAAE160&src-supplier=Digikey; ComponentLink2URL: http://www.farnell.com/datasheets/2095614.pdf?src-supplier=Element14; ComponentLink2Description: http://www.farnell.com/datasheets/2095614.pdf?src-supplier=Element14; Supplier Part Number 1: 80-A759EQ475M2AAE160
C51 = 0603 Capacitor: C1592; Created By: NourAldin; DataSheet Link: https://eu.mouser.com/datasheet/2/400/lcc_automotive_general_en-843974.pdf; Mouser Link: https://eu.mouser.com/ProductDetail/TDK/CGA1A2X7R1H331M030BA?qs=sGAEpiMZZMs0AnBnWHyRQL8L3bkL%252bvtyS9XpSB1mk7rVV5K8%252bbxEeg%3d%3d
LED4 = 1206 LED: C434438; Created By: NourAldin
Q3 = BSS138_MOSFET: as Q1 on sheet Stepper Motor1; Supplier: LCSC; Supplier Part: C400505; JLCPCB Part Class: Extended Part; spicePre: Q; spiceSymbolName: BSS138_C400505
R43 R44 R51 R55 R57 R59 R61 R62 = 0402 Resistor: C105871
R45 = 0603 Resistor: C2930081; Created By: NourAldin; Mouser Link: https://eu.mouser.com/ProductDetail/Panasonic/ERA-3AHD180V?qs=sGAEpiMZZMvdGkrng054t5mej2KPdPuFSlDBd1tSiF0%3d; DataSheet Link: https://eu.mouser.com/datasheet/2/315/AOA0000C307-1149632.pdf
R47 R49 = 0603 Resistor: C126359; Created By: NourAldin; Mouser Link: https://eu.mouser.com/ProductDetail/Panasonic/ERA-3AHD180V?qs=sGAEpiMZZMvdGkrng054t5mej2KPdPuFSlDBd1tSiF0%3d; DataSheet Link: https://eu.mouser.com/datasheet/2/315/AOA0000C307-1149632.pdf
R50 = 0603 Resistor: C100044; Created By: NourAldin; Mouser Link: https://eu.mouser.com/ProductDetail/Panasonic/ERA-3AHD180V?qs=sGAEpiMZZMvdGkrng054t5mej2KPdPuFSlDBd1tSiF0%3d; DataSheet Link: https://eu.mouser.com/datasheet/2/315/AOA0000C307-1149632.pdf
R52 = 0402 Resistor: C107230
R53 R54 = 2512 Resistor: C2903473; Created By: NourAldin; Mouser Link: https://eu.mouser.com/ProductDetail/Bourns/CSS2H-2512K-2L00F?qs=sGAEpiMZZMukHu%252bjC5l7YewuupLM8jZrvWs15Y6t0rY%3D&fbclid=IwAR0ZD_uc1Y03YG_KyYG8NxrpBzYgFzVeevvjxrlqtGWJ1HKz-jrYfqlFWCw; DataSheet Link: https://eu.mouser.com/datasheet/2/54/ss2h-2512-1302652.pdf
R56 R58 = 0402 Resistor: C105875
R60 = 0402 Resistor: C106235
Stepper3 = Header 4 Pin Polar: C144395
T8 T9 = MMBT3904 Transistor: C108429; Created By: NourAldin
U15 = TB6600HG: as U3 on sheet Stepper Motor1; Symbol: TB6600HG; Device: TB6600HG; LCSC Part Name: 4.5A 42V电机驱动芯片; Supplier Part: C66042; Manufacturer Part: TB6600HG; Supplier Footprint: HZIP-25-P-1mm; JLCPCB Part Class: Extended Part; Datasheet: https://atta.szlcsc.com/upload/public/pdf/source/20170511/1494500127812.pdf; Supplier: LCSC; Convert to PCB: yes
U16 = REF3318AIDBZR: as U4 on sheet Stepper Motor1; Symbol: REF3318AIDBZR; Device: REF3318AIDBZR; LCSC Part Name: REF3318AIDBZR; Supplier Part: C115877; Manufacturer Part: REF3318AIDBZR; Supplier Footprint: SOT-23; JLCPCB Part Class: Extended Part; Datasheet: https://www.ti.com/cn/lit/gpn/ref3318; Supplier: LCSC; Convert to PCB: yes; Noise - 10Hz to 10kHz: -; Operating Temperature: -40℃~+125℃@(Ta)
U17 U18 = 6N137S-TA1-L: as U5 on sheet Stepper Motor1; Symbol: 6N137S-TA1; Device: 6N137S-TA1-L; LCSC Part Name: DC输入 1通道; Supplier Part: C92651; Manufacturer Part: 6N137S-TA1-L; Supplier Footprint: SOP-8-2.54mm; JLCPCB Part Class: Extended Part; Datasheet: https://atta.szlcsc.com/upload/public/pdf/source/20191018/C92651_D1F9F6F1F10C7EC7C3739E5ECB700036.pdf; Supplier: LCSC; Convert to PCB: yes; Operating Temperature: -40℃~+85℃
U19 = TLP291(GB-TP,SE(T: C55144; BOM_Manufacturer: TOSHIBA(东芝); BOM_Supplier: LCSC; Manufacturer Part Number: TLP291(GB-TP,SE; Supplier Part Number 2: C55144; BOM_JLCPCB Part Class: Extended Part; LCSC Link: https://www.lcsc.com/product-detail/Optocouplers-Phototransistor-Output_TOSHIBA-TLP291-GB-TP-SE_C55144.html; spiceSymbolName: TLP291(GB-TP,SE(T

## Sheet Stepper Motor4.SchDoc
size A2; SheetNumber: 7; SheetTotal: 9
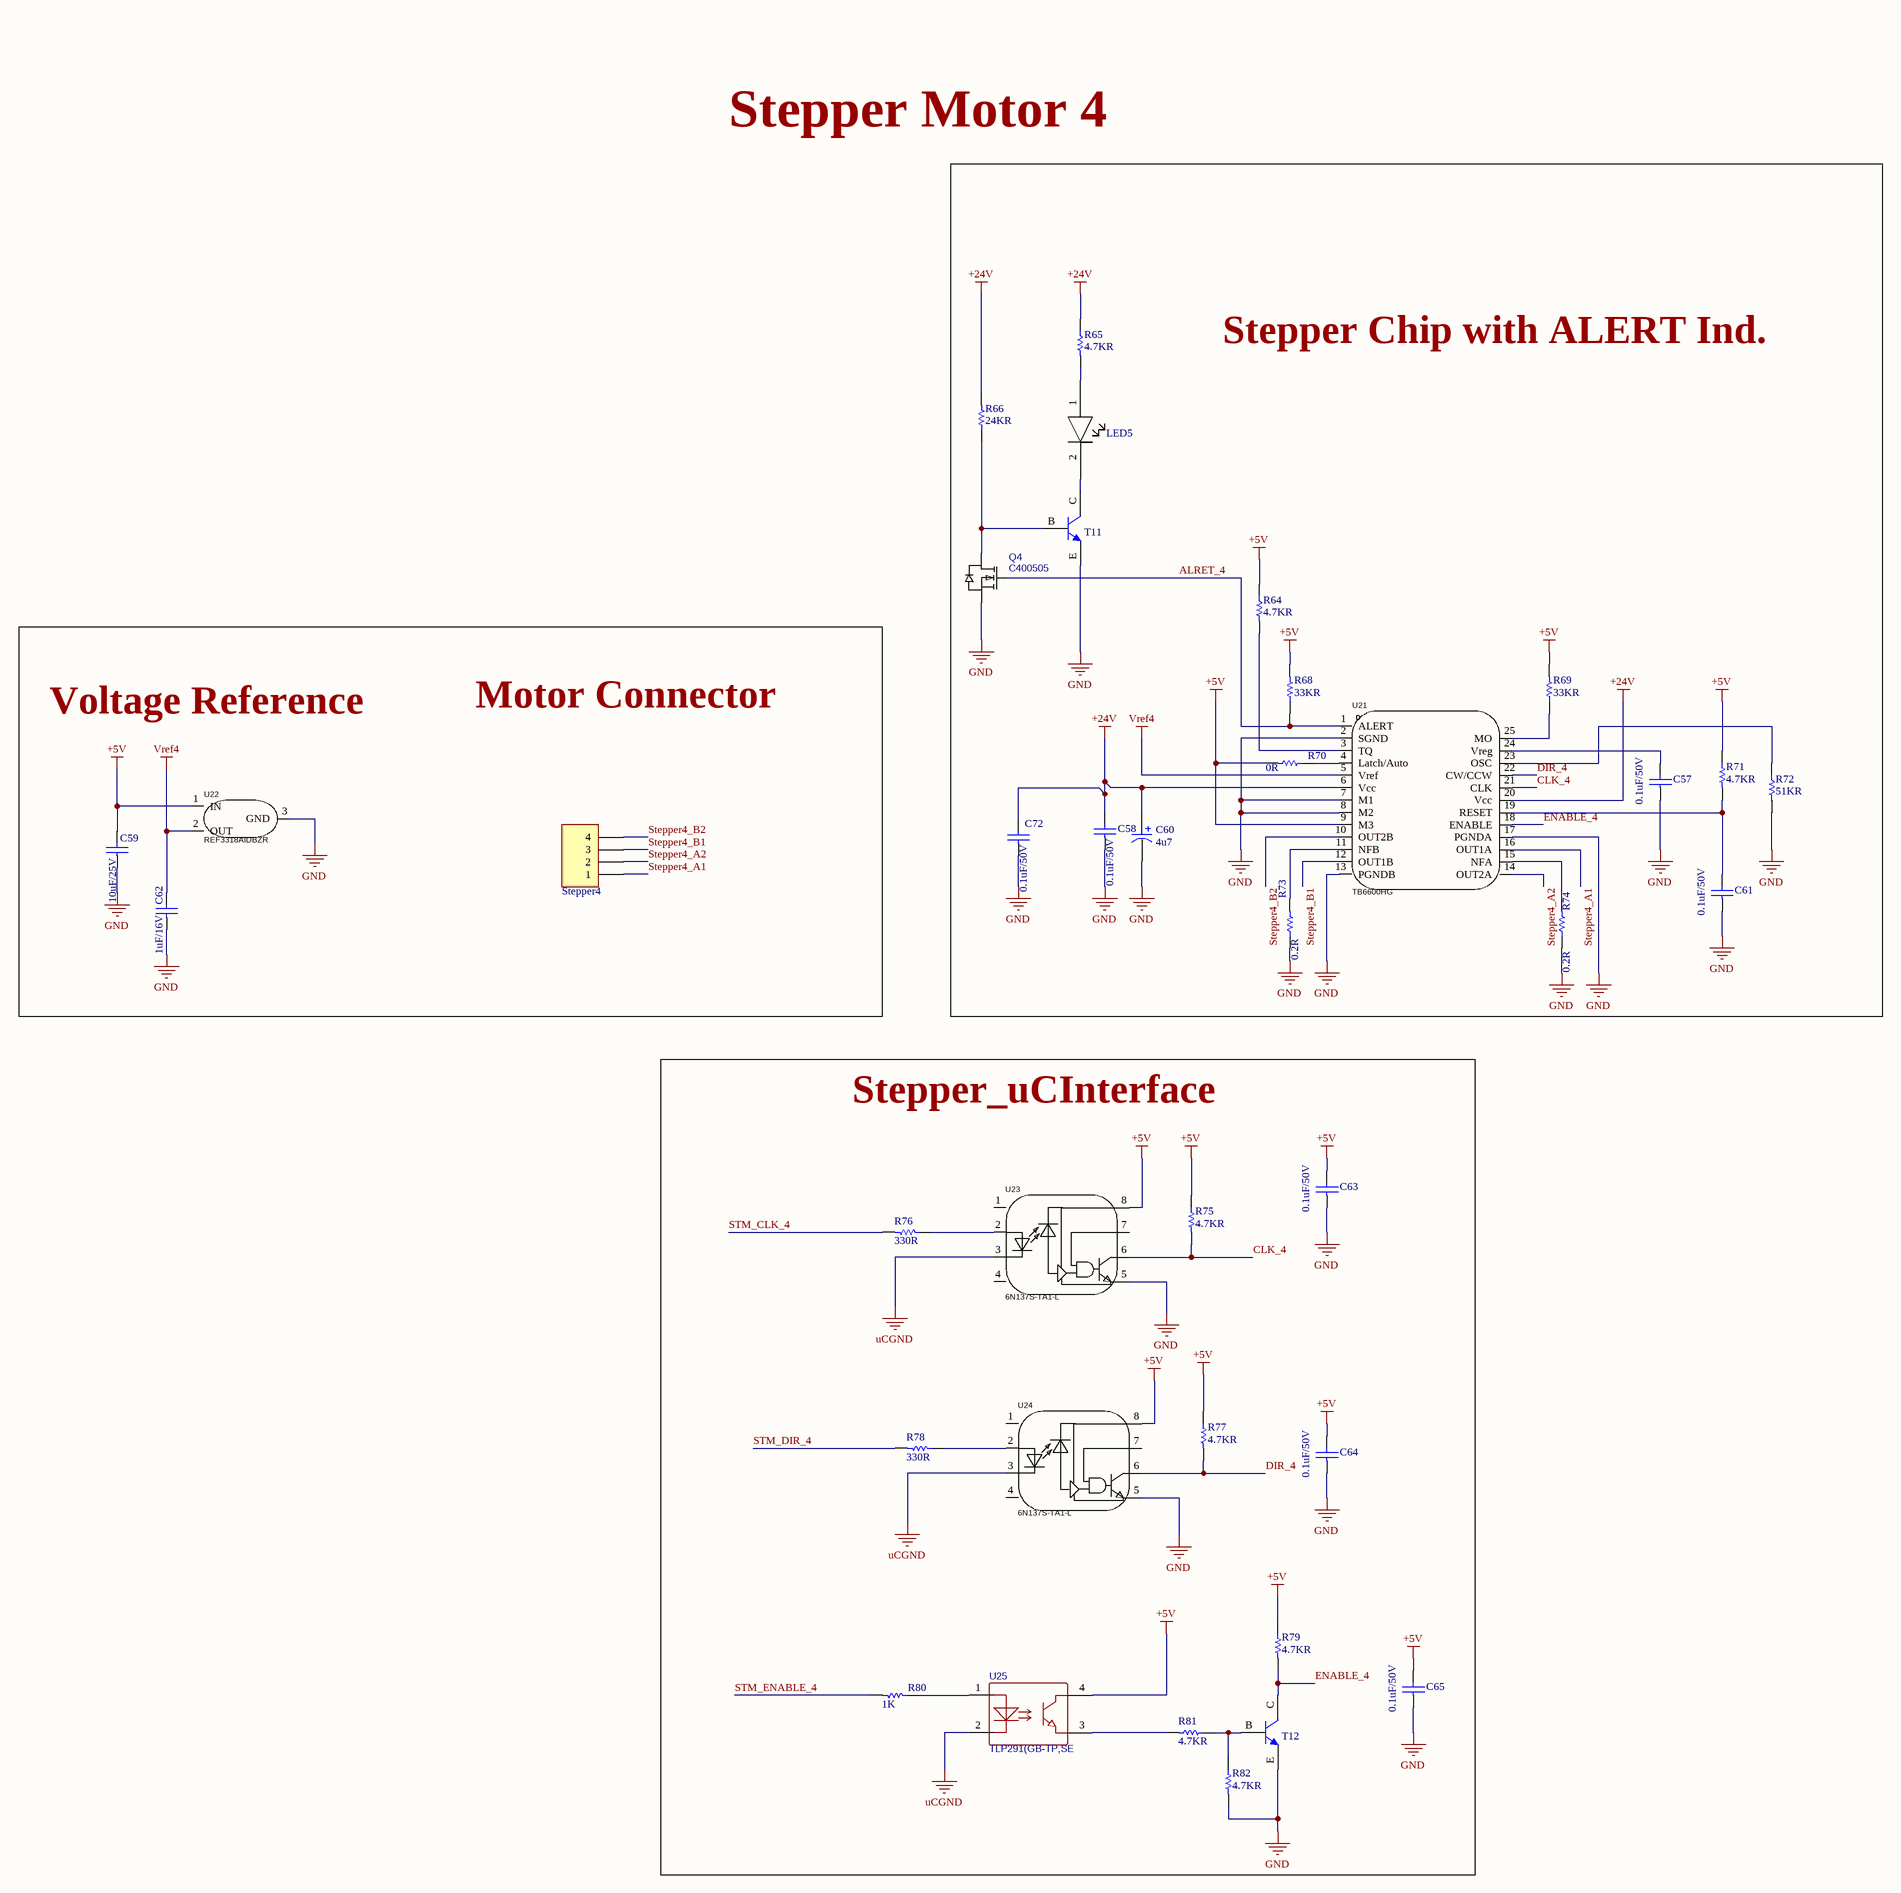
[diagram p6: Stepper Motor4.SchDoc]

### Parts
C57  0.1uF/50V  [PCBComponent_1]
C58  0.1uF/50V  [PCBComponent_1]
C59  10uF/25V  [PCBComponent_1]
C60  4u7  [CAPLEAD_D6.3mm]
C61  0.1uF/50V  [PCBComponent_1]
C62  1uF/16V  [PCBComponent_1]
C63  0.1uF/50V  [PCBComponent_1]
C64  0.1uF/50V  [PCBComponent_1]
C65  0.1uF/50V  [PCBComponent_1]
C72  0.1uF/50V  [PCBComponent_1]
LED5  1206 LED  [1206 LED]  (value not drawn)
Q4  C400505  [SOT-23-3_L2.9-W1.3-P1.90-LS2.4-BR]
R64  4.7KR  [R0402]
R65  4.7KR  [R0402]
R66  24KR  [RESC1608X06N]
R68  33KR  [RESC1608X06N]
R69  33KR  [RESC1608X06N]
R70  0R  [RESC1608X06N]
R71  4.7KR  [R0402]
R72  51KR  [R0402]
R73  0.2R  [RESC6431X12N]
R74  0.2R  [RESC6431X12N]
R75  4.7KR  [R0402]
R76  330R  [R0402]
R77  4.7KR  [R0402]
R78  330R  [R0402]
R79  4.7KR  [R0402]
R80  1K  [R0402]
R81  4.7KR  [R0402]
R82  4.7KR  [R0402]
Stepper4  Header 4 Pin Polar  [PCBComponent_1]  (value not drawn)
T11  MMBT3904 Transistor  [MMBT3904]  (value not drawn)
T12  MMBT3904 Transistor  [MMBT3904]  (value not drawn)
U21  TB6600HG  [HZIP25-P-1.0_TB6600HG - HEATSINK]
U22  REF3318AIDBZR  [SOT-23-3_L2.9-W1.3-P1.90-LS2.4-BR]
U23  6N137S-TA1-L  [SOP-8_L9.8-W6.6-P2.54-LS10.3-BL]
U24  6N137S-TA1-L  [SOP-8_L9.8-W6.6-P2.54-LS10.3-BL]
U25  TLP291(GB-TP,SE  [SOP-4-1.27mm]

### Blocks framed on the sheet
Stepper Chip with ALERT Ind.: C57 C58 C60 C61 C72 LED5 Q4 R64-R66 R68-R74 T11 U21
Stepper_uCInterface: C63-C65 R75-R82 T12 U23-U25

### Nets
+5V: C59.2 C63.2 C64.2 C65.2 R64.1 R68.2 R69.2 R70.2 R71.1 R75.1 R77.1 R79.1 U21.9(M3) U22.1(IN) U23.8 U24.8 U25.4
+24V: C58.2 C60.1 C72.2 R65.1 R66.2 U21.6(Vcc) U21.20(Vcc)
GND: C57.1 C58.1 C59.1 C60.2 C61.1 C62.1 C63.1 C64.1 C65.1 C72.1 Q4.2(S) R72.2 R73.1 R74.1 R82.2 T11.E T12.E U21.2(SGND) U21.7(M1) U21.8(M2) U21.13(PGNDB) U21.17(PGNDA) U22.3(GND) U23.5 U24.5
uCGND: U23.3 U24.3 U25.2
Vref4: C62.2 U21.5(Vref) U22.2(OUT)
ALRET_4: Q4.1(G) R68.1 U21.1(ALERT)
CLK_4: R75.2 U21.21(CLK) U23.6
DIR_4: R77.2 U21.22(CW/CCW) U24.6
ENABLE_4: R79.2 T12.C U21.18(ENABLE)
Stepper4_A1: Stepper4.1 U21.16(OUT1A)
Stepper4_A2: Stepper4.2 U21.14(OUT2A)
Stepper4_B1: Stepper4.3 U21.12(OUT1B)
Stepper4_B2: Stepper4.4 U21.10(OUT2B)
STM_CLK_4: R76.2
STM_DIR_4: R78.2
STM_ENABLE_4: R80.2
NetC57_2: C57.2 U21.24(Vreg)
NetC61_2: C61.2 R71.2 U21.19(RESET)
NetLED5_1: LED5.1 R65.2
NetLED5_2: LED5.2 T11.C
NetQ4_3: Q4.3(D) R66.1 T11.B
NetR64_2: R64.2 U21.3(TQ)
NetR69_1: R69.1 U21.25(MO)
NetR70_1: R70.1 U21.4(Latch/Auto)
NetR72_1: R72.1 U21.23(OSC)
NetR73_2: R73.2 U21.11(NFB)
NetR74_2: R74.2 U21.15(NFA)
NetR76_1: R76.1 U23.2
NetR78_1: R78.1 U24.2
NetR80_1: R80.1 U25.1
NetR81_1: R81.1 R82.1 T12.B
NetR81_2: R81.2 U25.3

Not connected (* = marked no-connect by the designer): U23 1(NC) 4(NC) 7; U24 1(NC) 4(NC) 7

### Notes on the sheet
- Stepper Motor 4
- Motor Connector
- Voltage Reference

### Library data of the parts
C57 C58 C61 C63-C65 C72 = 0603 Capacitor: C1591; Created By: NourAldin; DataSheet Link: https://eu.mouser.com/datasheet/2/400/lcc_automotive_general_en-843974.pdf; Mouser Link: https://eu.mouser.com/ProductDetail/TDK/CGA1A2X7R1H331M030BA?qs=sGAEpiMZZMs0AnBnWHyRQL8L3bkL%252bvtyS9XpSB1mk7rVV5K8%252bbxEeg%3d%3d
C59 = 0603 Capacitor: C96446; Created By: NourAldin; DataSheet Link: https://eu.mouser.com/datasheet/2/400/lcc_automotive_general_en-843974.pdf; Mouser Link: https://eu.mouser.com/ProductDetail/TDK/CGA1A2X7R1H331M030BA?qs=sGAEpiMZZMs0AnBnWHyRQL8L3bkL%252bvtyS9XpSB1mk7rVV5K8%252bbxEeg%3d%3d
C60 = A759EQ475M2AAAE160: C2691843; Manufacturer: KEMET; Supplier 1: Mouser; Manufacturer Part Number: A759EQ475M2AAAE160; RoHS: Yes; Category: Polymer Capacitors; Stock 1: 17219; Pricing 1: 1=0.97, 10=0.73, 50=0.73, 100=0.546, 1000=0.384, 10000=0.326 (USD); ComponentLink1URL: http://www.kemet.com/docfinder?Partnumber=A759EQ475M2AAAE160&src-supplier=Digikey; ComponentLink1Description: http://www.kemet.com/docfinder?Partnumber=A759EQ475M2AAAE160&src-supplier=Digikey; ComponentLink2URL: http://www.farnell.com/datasheets/2095614.pdf?src-supplier=Element14; ComponentLink2Description: http://www.farnell.com/datasheets/2095614.pdf?src-supplier=Element14; Supplier Part Number 1: 80-A759EQ475M2AAE160
C62 = 0603 Capacitor: C1592; Created By: NourAldin; DataSheet Link: https://eu.mouser.com/datasheet/2/400/lcc_automotive_general_en-843974.pdf; Mouser Link: https://eu.mouser.com/ProductDetail/TDK/CGA1A2X7R1H331M030BA?qs=sGAEpiMZZMs0AnBnWHyRQL8L3bkL%252bvtyS9XpSB1mk7rVV5K8%252bbxEeg%3d%3d
LED5 = 1206 LED: C434438; Created By: NourAldin
Q4 = BSS138_MOSFET: as Q1 on sheet Stepper Motor1; Supplier: LCSC; Supplier Part: C400505; JLCPCB Part Class: Extended Part; spicePre: Q; spiceSymbolName: BSS138_C400505
R64 R65 R71 R75 R77 R79 R81 R82 = 0402 Resistor: C105871
R66 = 0603 Resistor: C2930081; Created By: NourAldin; Mouser Link: https://eu.mouser.com/ProductDetail/Panasonic/ERA-3AHD180V?qs=sGAEpiMZZMvdGkrng054t5mej2KPdPuFSlDBd1tSiF0%3d; DataSheet Link: https://eu.mouser.com/datasheet/2/315/AOA0000C307-1149632.pdf
R68 R69 = 0603 Resistor: C126359; Created By: NourAldin; Mouser Link: https://eu.mouser.com/ProductDetail/Panasonic/ERA-3AHD180V?qs=sGAEpiMZZMvdGkrng054t5mej2KPdPuFSlDBd1tSiF0%3d; DataSheet Link: https://eu.mouser.com/datasheet/2/315/AOA0000C307-1149632.pdf
R70 = 0603 Resistor: C100044; Created By: NourAldin; Mouser Link: https://eu.mouser.com/ProductDetail/Panasonic/ERA-3AHD180V?qs=sGAEpiMZZMvdGkrng054t5mej2KPdPuFSlDBd1tSiF0%3d; DataSheet Link: https://eu.mouser.com/datasheet/2/315/AOA0000C307-1149632.pdf
R72 = 0402 Resistor: C107230
R73 R74 = 2512 Resistor: C2903473; Created By: NourAldin; Mouser Link: https://eu.mouser.com/ProductDetail/Bourns/CSS2H-2512K-2L00F?qs=sGAEpiMZZMukHu%252bjC5l7YewuupLM8jZrvWs15Y6t0rY%3D&fbclid=IwAR0ZD_uc1Y03YG_KyYG8NxrpBzYgFzVeevvjxrlqtGWJ1HKz-jrYfqlFWCw; DataSheet Link: https://eu.mouser.com/datasheet/2/54/ss2h-2512-1302652.pdf
R76 R78 = 0402 Resistor: C105875
R80 = 0402 Resistor: C106235
Stepper4 = Header 4 Pin Polar: C144395
T11 T12 = MMBT3904 Transistor: C108429; Created By: NourAldin
U21 = TB6600HG: as U3 on sheet Stepper Motor1; Symbol: TB6600HG; Device: TB6600HG; LCSC Part Name: 4.5A 42V电机驱动芯片; Supplier Part: C66042; Manufacturer Part: TB6600HG; Supplier Footprint: HZIP-25-P-1mm; JLCPCB Part Class: Extended Part; Datasheet: https://atta.szlcsc.com/upload/public/pdf/source/20170511/1494500127812.pdf; Supplier: LCSC; Convert to PCB: yes
U22 = REF3318AIDBZR: as U4 on sheet Stepper Motor1; Symbol: REF3318AIDBZR; Device: REF3318AIDBZR; LCSC Part Name: REF3318AIDBZR; Supplier Part: C115877; Manufacturer Part: REF3318AIDBZR; Supplier Footprint: SOT-23; JLCPCB Part Class: Extended Part; Datasheet: https://www.ti.com/cn/lit/gpn/ref3318; Supplier: LCSC; Convert to PCB: yes; Noise - 10Hz to 10kHz: -; Operating Temperature: -40℃~+125℃@(Ta)
U23 U24 = 6N137S-TA1-L: as U5 on sheet Stepper Motor1; Symbol: 6N137S-TA1; Device: 6N137S-TA1-L; LCSC Part Name: DC输入 1通道; Supplier Part: C92651; Manufacturer Part: 6N137S-TA1-L; Supplier Footprint: SOP-8-2.54mm; JLCPCB Part Class: Extended Part; Datasheet: https://atta.szlcsc.com/upload/public/pdf/source/20191018/C92651_D1F9F6F1F10C7EC7C3739E5ECB700036.pdf; Supplier: LCSC; Convert to PCB: yes; Operating Temperature: -40℃~+85℃
U25 = TLP291(GB-TP,SE(T: C55144; BOM_Manufacturer: TOSHIBA(东芝); BOM_Supplier: LCSC; Manufacturer Part Number: TLP291(GB-TP,SE; Supplier Part Number 2: C55144; BOM_JLCPCB Part Class: Extended Part; LCSC Link: https://www.lcsc.com/product-detail/Optocouplers-Phototransistor-Output_TOSHIBA-TLP291-GB-TP-SE_C55144.html; spiceSymbolName: TLP291(GB-TP,SE(T